# EAGLE design Čos - POC (EAGLE 9.4.0)
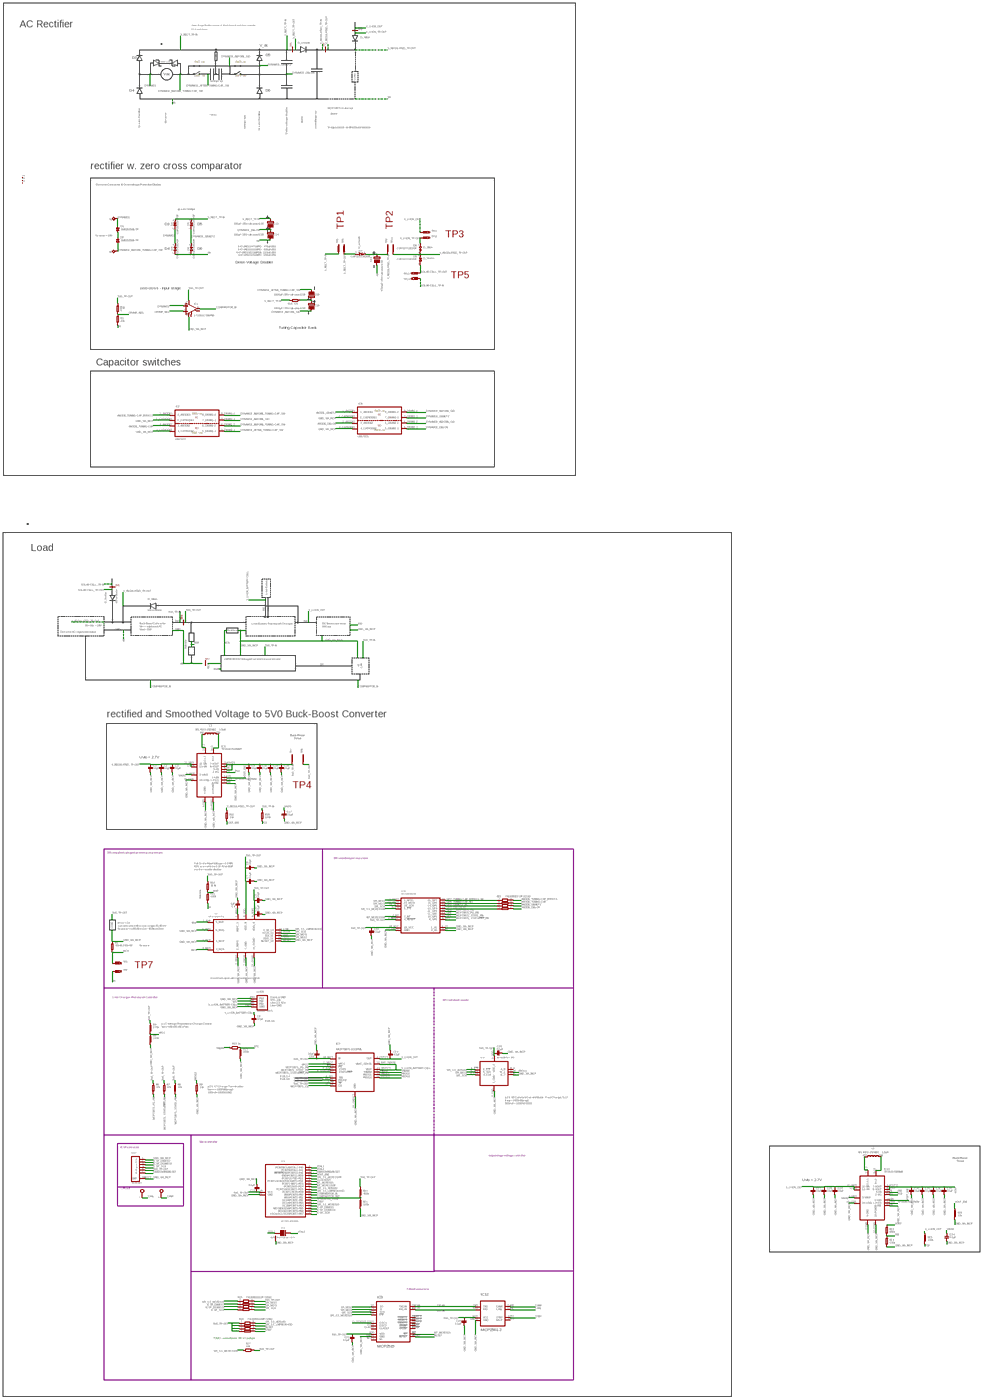
[diagram p0: schematic, sheet 1, overview]
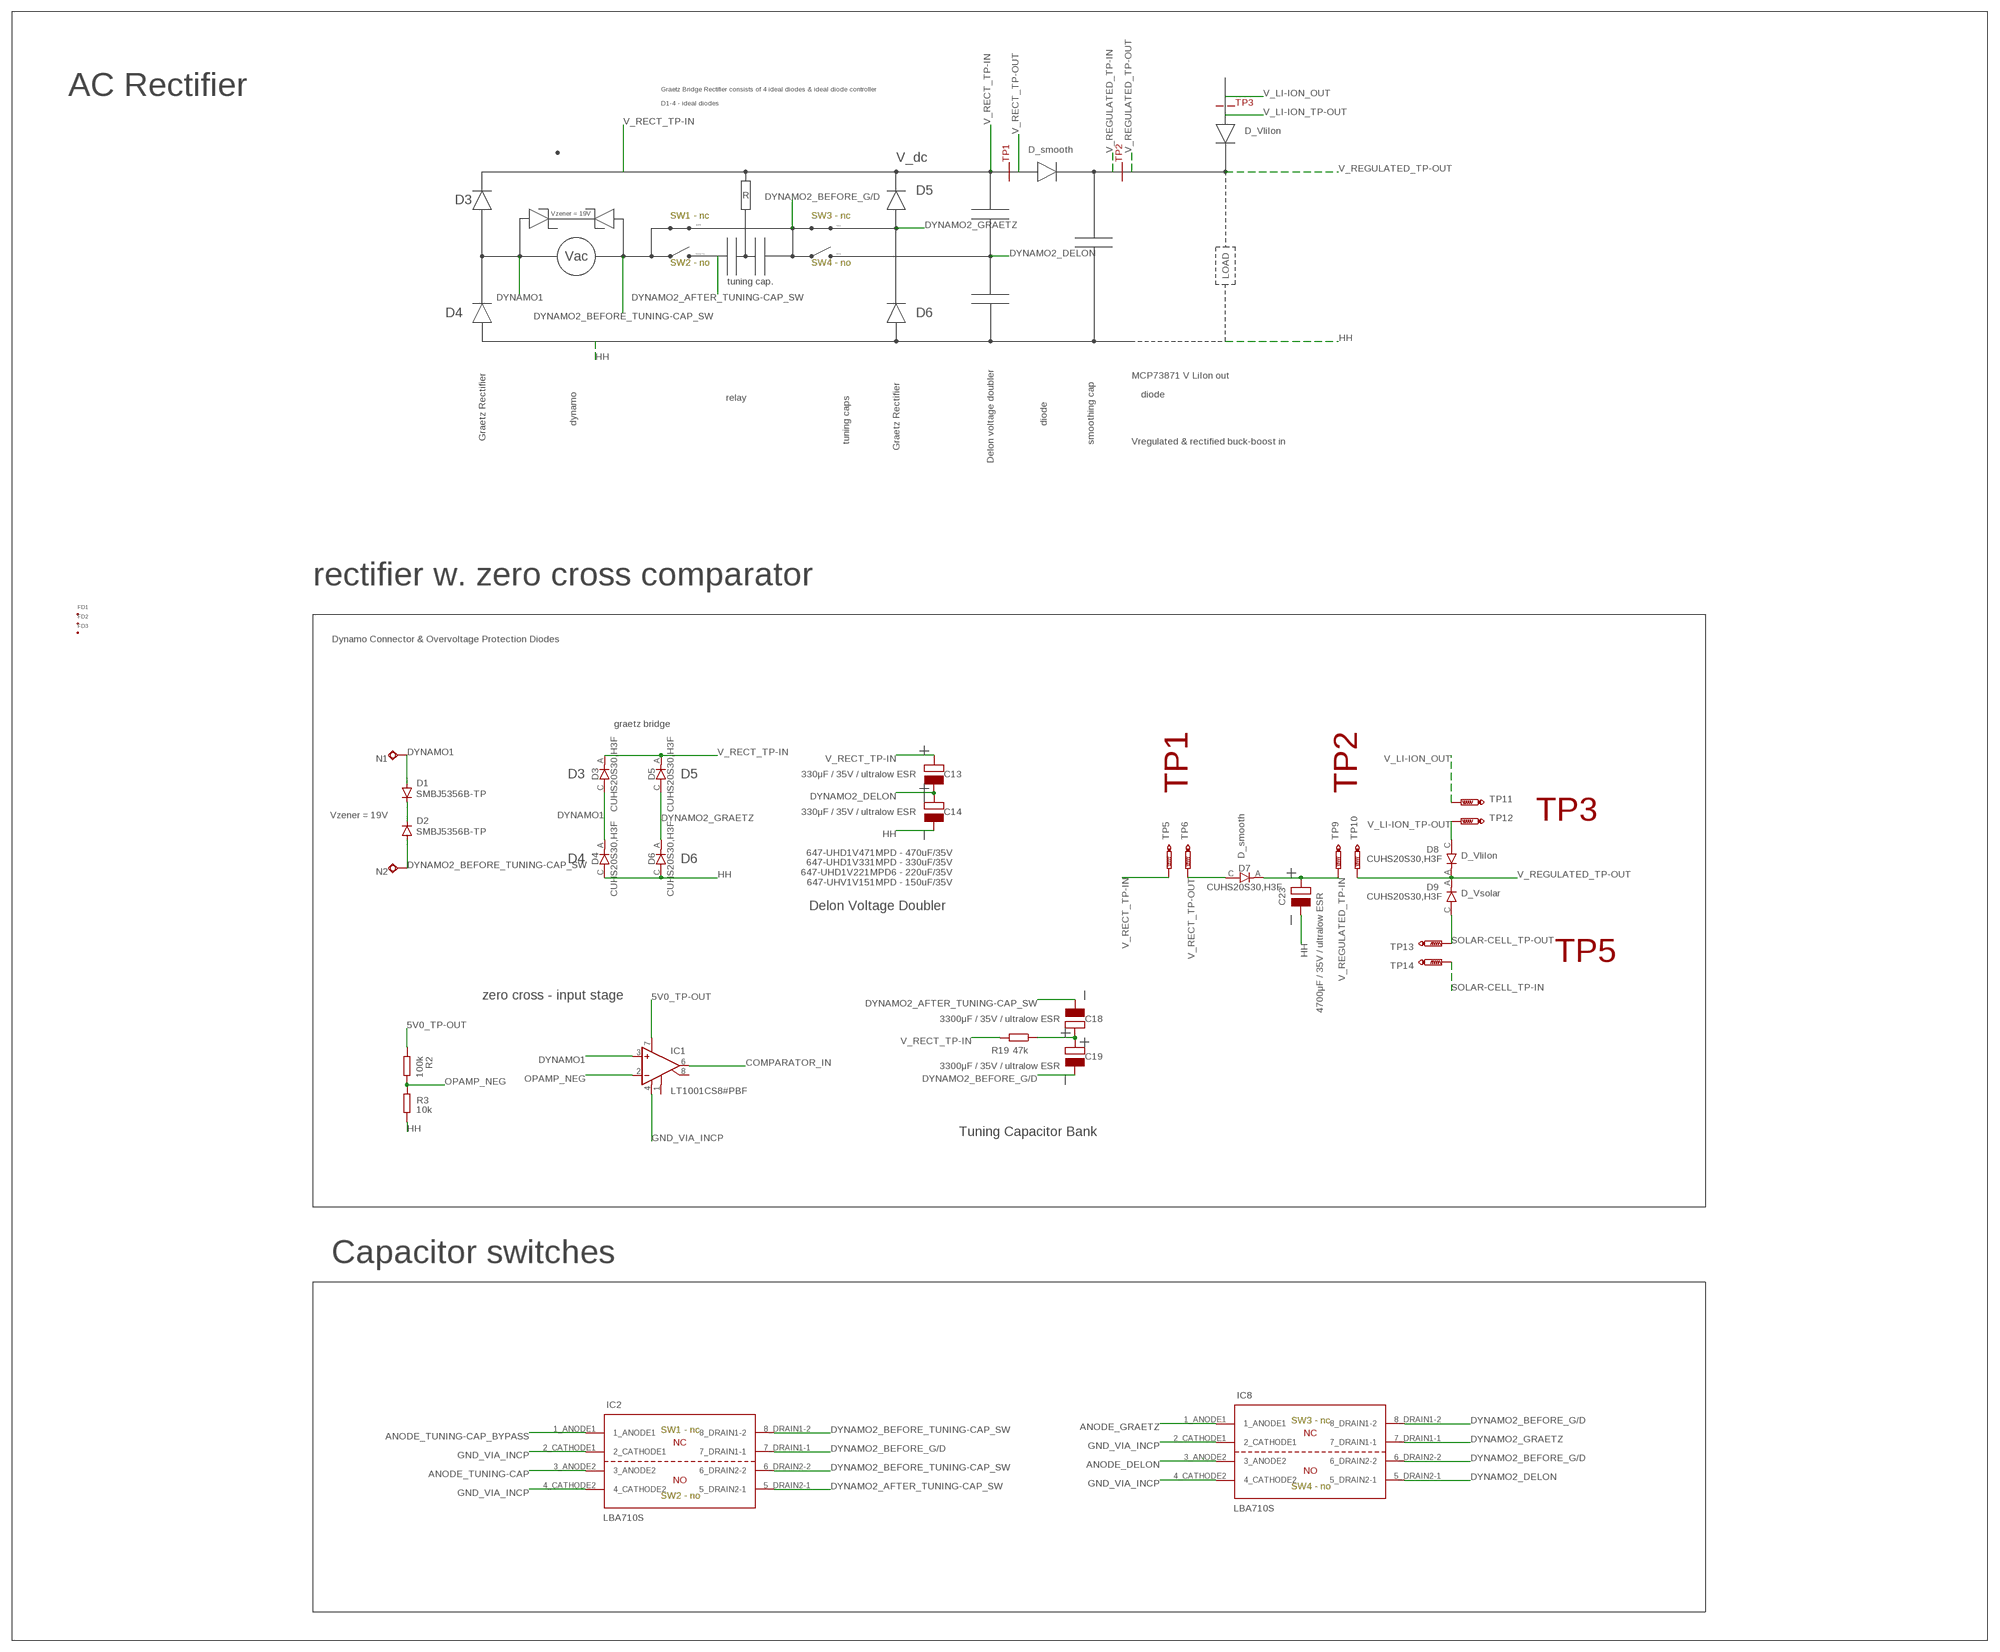
[diagram p1: schematic, sheet 1, part 1 of 5]
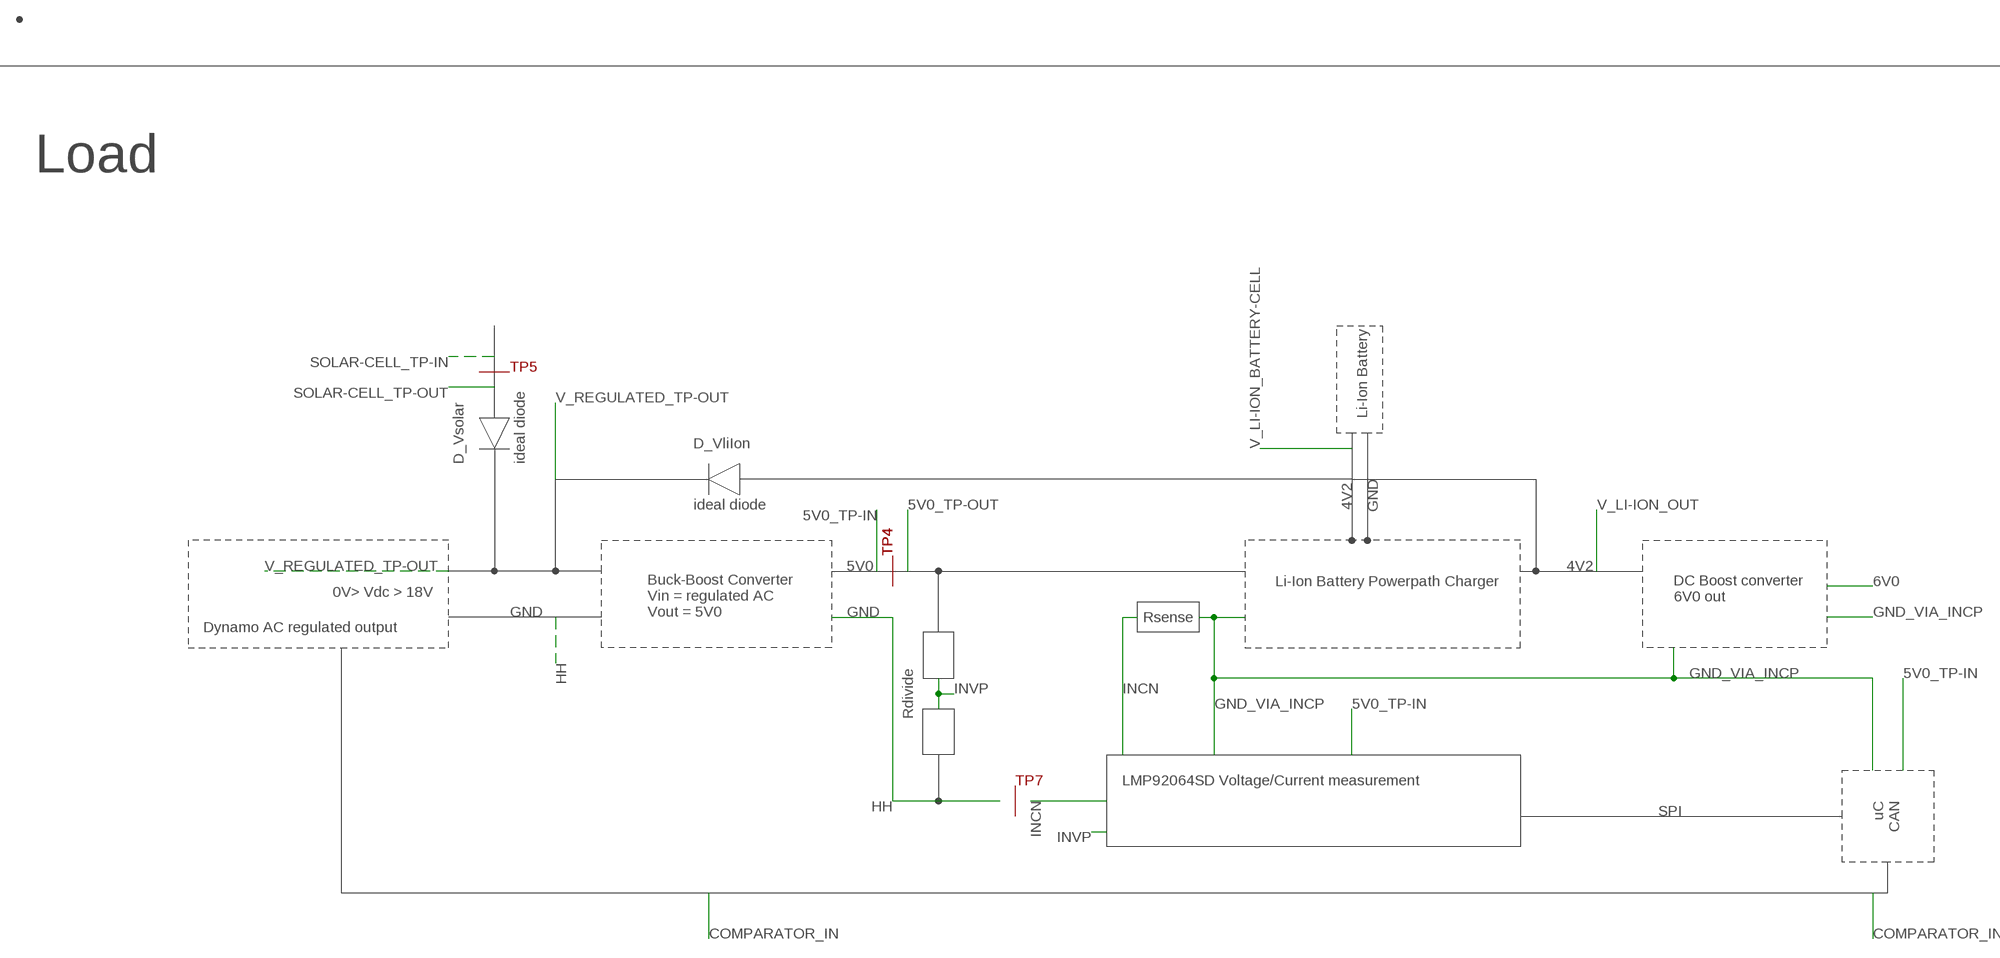
[diagram p2: schematic, sheet 1, part 2 of 5]
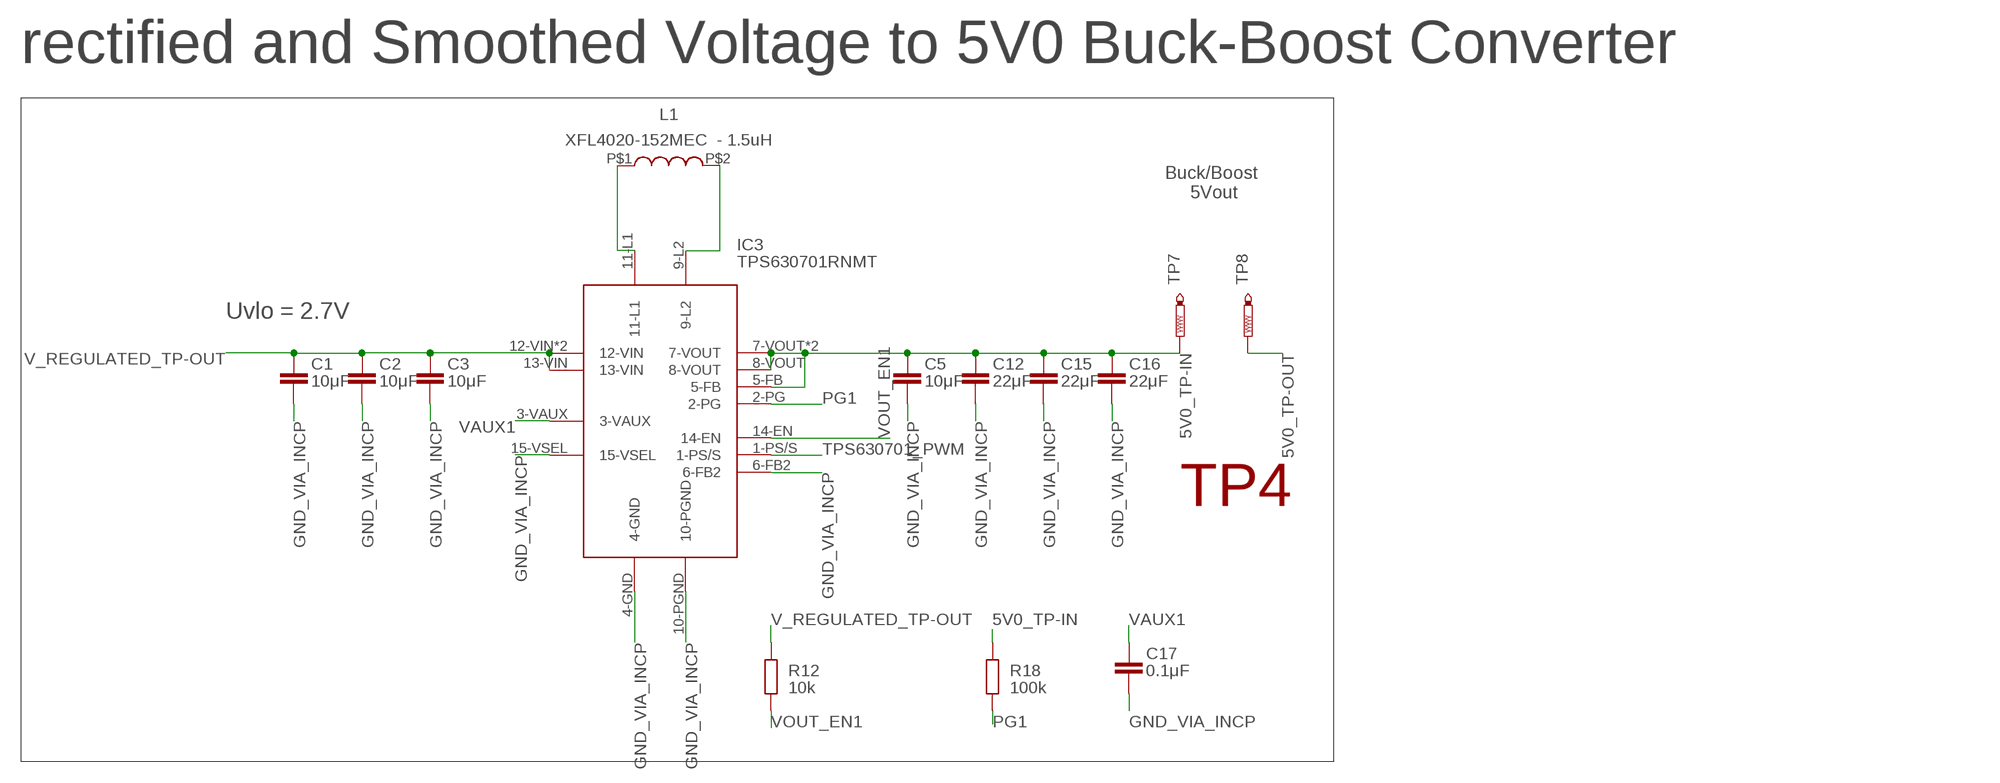
[diagram p3: schematic, sheet 1, part 3 of 5]
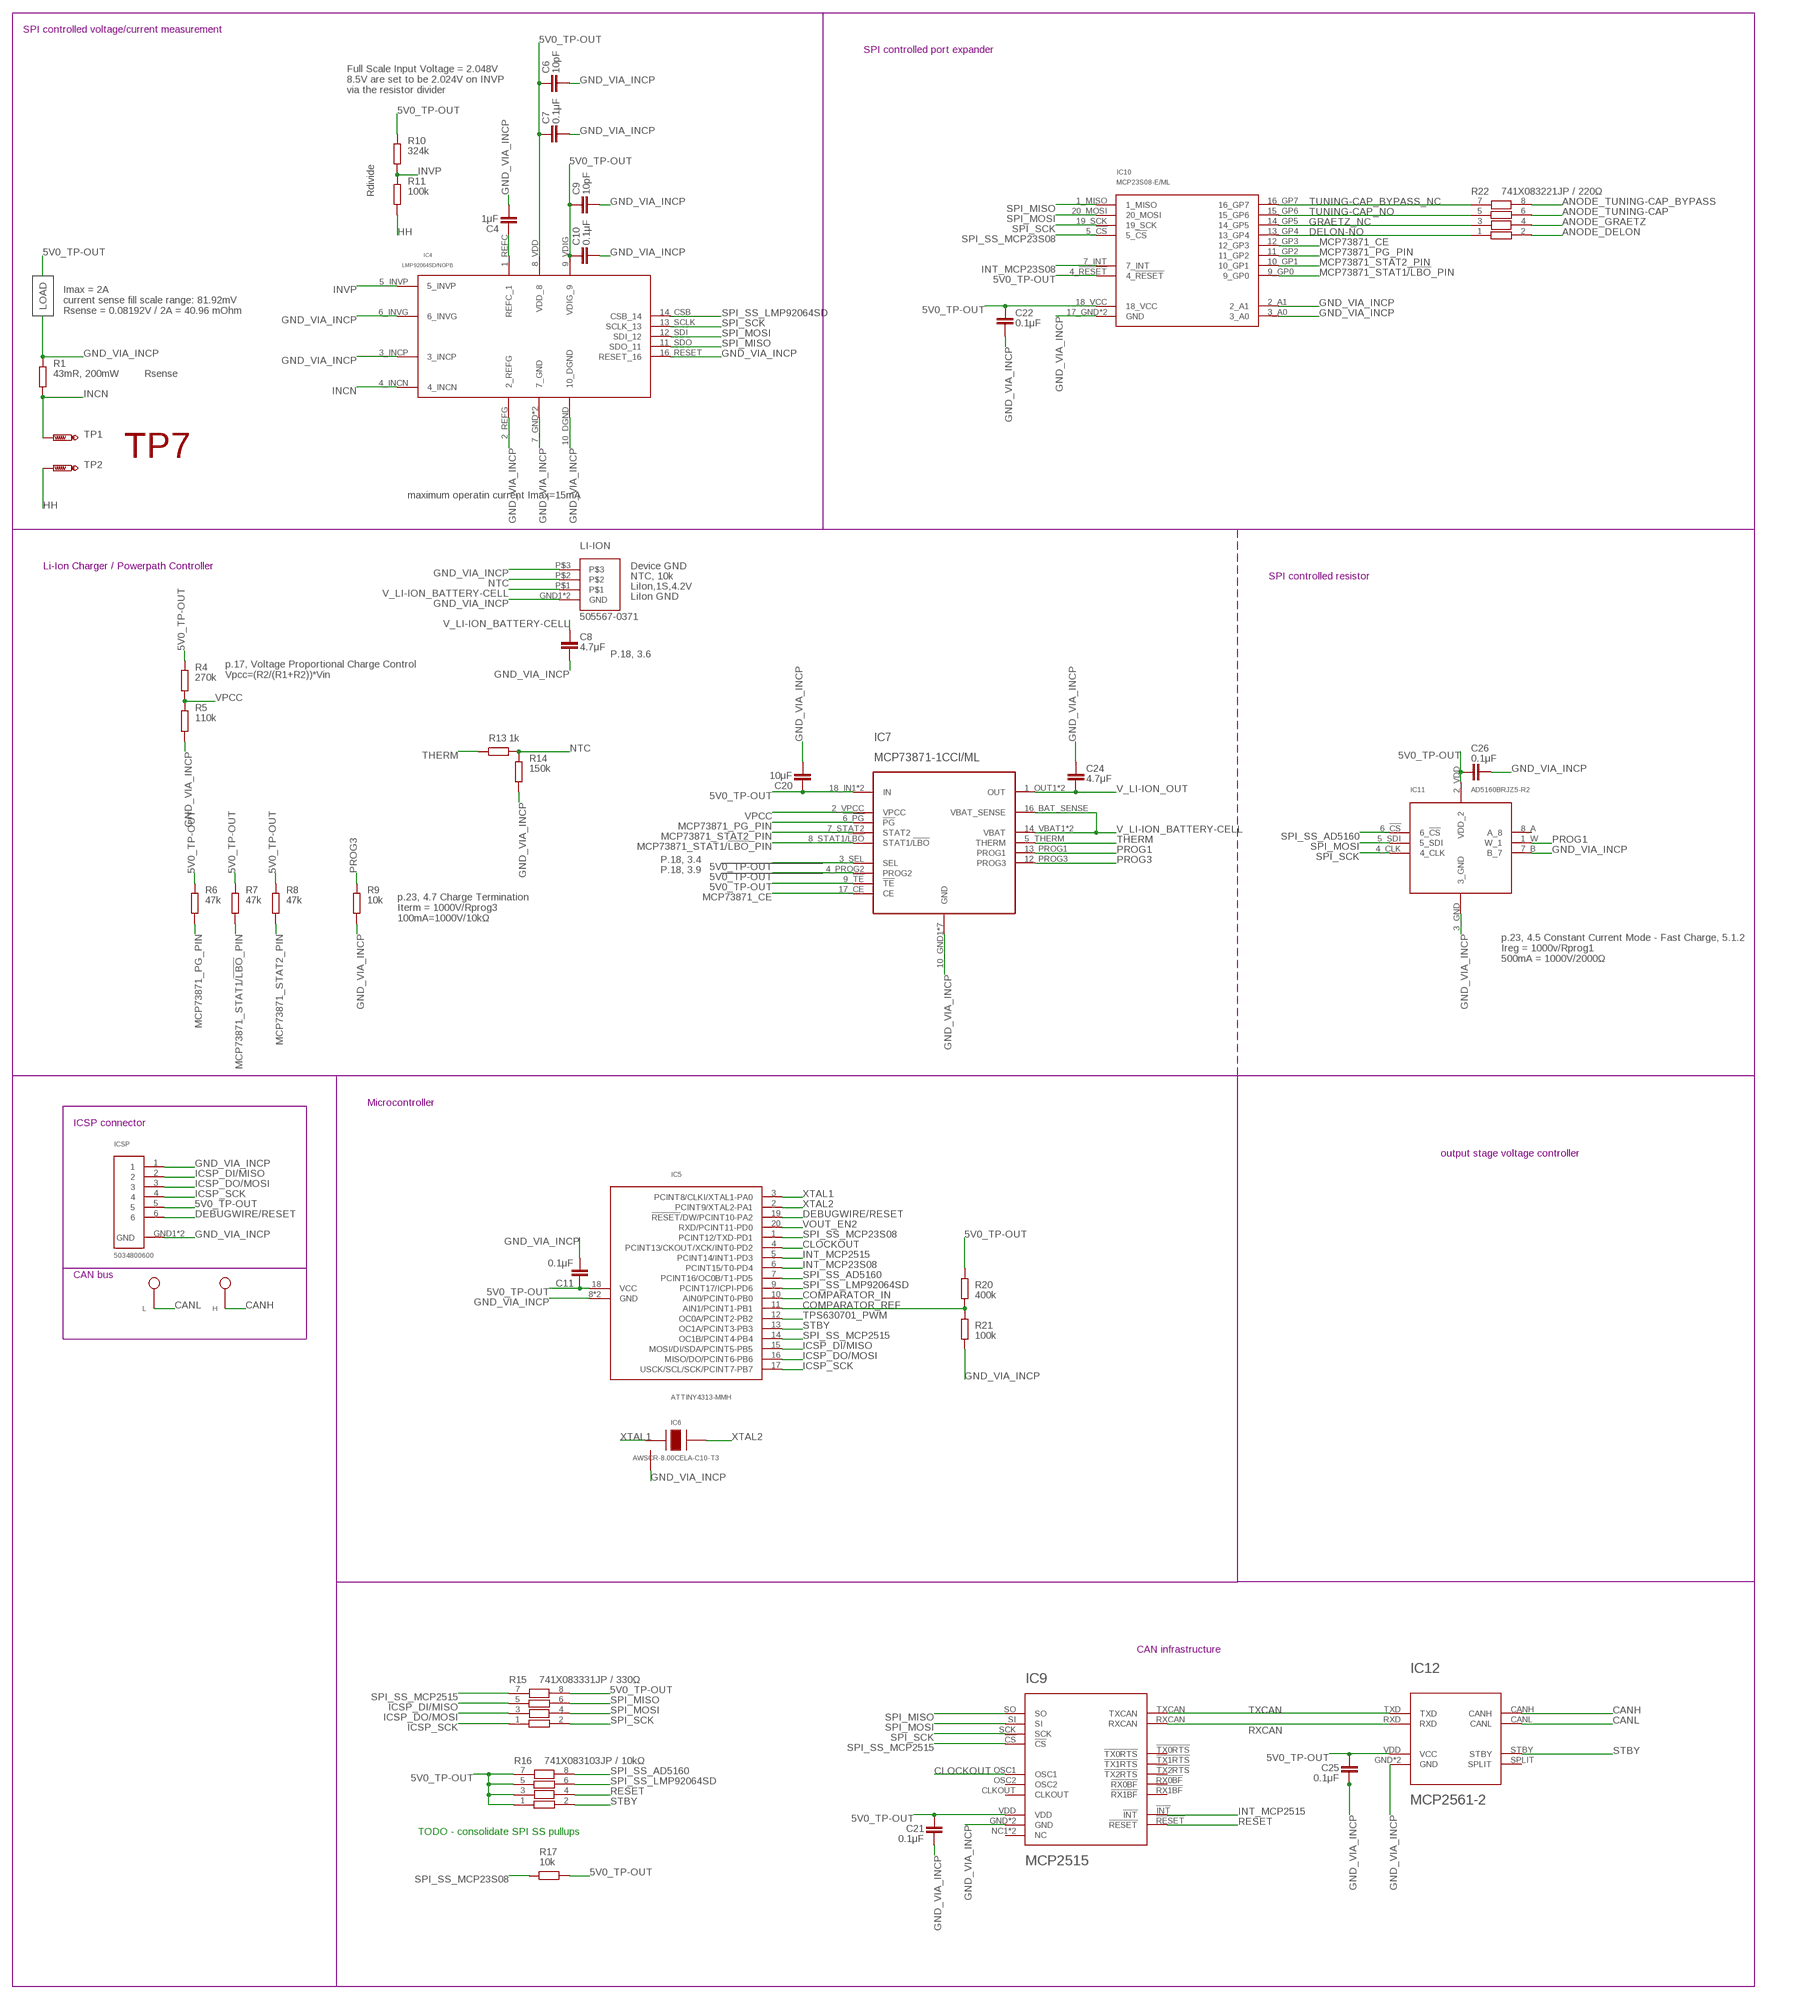
[diagram p4: schematic, sheet 1, part 4 of 5]
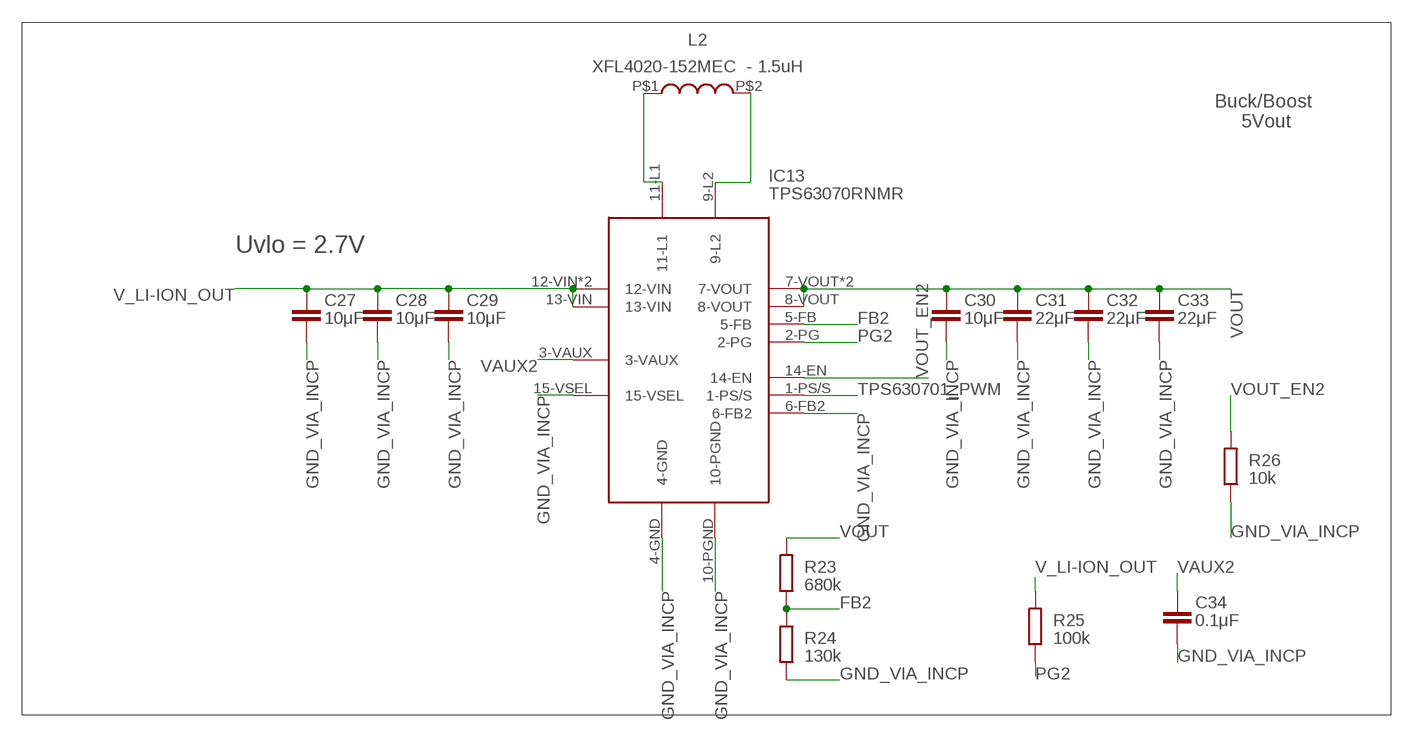
[diagram p5: schematic, sheet 1, part 5 of 5]

## Parts
C1  10μF  C-EUC0805  [C0805]
C2  10μF  C-EUC0805  [C0805]
C3  10μF  C-EUC0603  [C0603]
C4  1μF  C-EUC0402  [C0402]
C5  10μF  C-EUC0603  [C0603]
C6  10pF  C-EUC0402  [C0402]
C7  0.1μF  C-EUC0402  [C0402]
C8  4.7μF  C-EUC0402  [C0402]
C9  10pF  C-EUC0402  [C0402]
C10  0.1μF  C-EUC0402  [C0402]
C11  0.1μF  C-EUC0402  [C0402]
C12  22μF  C-EUC0805  [C0805]
C13  330μF / 35V / ultralow ESR  C-POL  [TH]
C14  330μF / 35V / ultralow ESR  C-POL  [TH]
C15  22μF  C-EUC0805  [C0805]
C16  22μF  C-EUC0805  [C0805]
C17  0.1μF  C-EUC0402  [C0402]
C18  3300μF / 35V / ultralow ESR  C-POL  [TH]
C19  3300μF / 35V / ultralow ESR  C-POL  [TH]
C20  10μF  C-EUC0402  [C0402]
C21  0.1μF  C-EUC0402  [C0402]
C22  0.1μF  C-EUC0402  [C0402]
C23  4700μF / 35V / ultralow ESR  C-POL  [TH]
C24  4.7μF  C-EUC0402  [C0402]
C25  0.1μF  C-EUC0402  [C0402]
C26  0.1μF  C-EUC0402  [C0402]
C27  10μF  C-EUC0805  [C0805]
C28  10μF  C-EUC0805  [C0805]
C29  10μF  C-EUC0603  [C0603]
C30  10μF  C-EUC0603  [C0603]
C31  22μF  C-EUC0805  [C0805]
C32  22μF  C-EUC0805  [C0805]
C33  22μF  C-EUC0805  [C0805]
C34  0.1μF  C-EUC0402  [C0402]
D1  SMBJ5356B-TP  DIODE-DO214AA  [DO214AA]
D2  SMBJ5356B-TP  DIODE-DO214AA  [DO214AA]
D3  CUHS20S30,H3F  CUHS20S30  [US2H]
D4  CUHS20S30,H3F  CUHS20S30  [US2H]
D5  CUHS20S30,H3F  CUHS20S30  [US2H]
D6  CUHS20S30,H3F  CUHS20S30  [US2H]
D7  CUHS20S30,H3F  CUHS20S30  [US2H]
D8  CUHS20S30,H3F  CUHS20S30  [US2H]
D9  CUHS20S30,H3F  CUHS20S30  [US2H]
FD1  FID_40MIL  [FID_040]
FD2  FID_40MIL  [FID_040]
FD3  FID_40MIL  [FID_040]
H  CAN High  TPSMT-1.2MM  [SMT-1.2MM]
IC1  LT1001CS8#PBF  LT1007CS8  [SO08]
IC2  LBA710S  LBA710  [SMD_DIP6]
IC3  TPS630701RNMT  TPS630701  [VQFN]
IC4  LMP92064SD/NOPB  LMP92064SD  [WSON-16]
IC5  ATTINY4313-MMH  ATTINY4313VQFN-20  [VQFN-20]
IC6  AWSCR-8.00CELA-C10-T3  PRQV  [SMT]
IC7  MCP73871-1CCI/ML  MCP73871-2AAI/ML  [QFN50P400X400X100-21N]
IC8  LBA710S  LBA710  [SMD_DIP6]
IC9  MCP2515  MCP2515-I-ML  [QFN20]
IC10  MCP23S08-E/ML  MCP23S08  [QFN20]
IC11  AD5160BRJZ5-R2  AD5160  [SOT-23-8]
IC12  MCP2561-2  [DFN10]
IC13  TPS63070RNMR  TPS630701  [VQFN]
ICSP  5034800600  [SMT]
L  CAN Low  TPSMT-1.2MM  [SMT-1.2MM]
L1  XFL4020-152MEC - 1.5uH  XFL4020-152MEC  [SMD]
L2  XFL4020-152MEC - 1.5uH  XFL4020-152MEC  [SMD]
LI-ION  505567-0371  505567  [SMT]
N1  Li-Ion Cell +  TPSQPAD1-13  [P1-13]
N2  Li-Ion Cell +  TPSQPAD1-13  [P1-13]
R1  43mR, 200mW  R-EU_R2512  [R2512]
R2  100k  R-EU_R0402  [R0402]
R3  10k  R-EU_R0402  [R0402]
R4  270k  R-EU_R0402  [R0402]
R5  110k  R-EU_R0402  [R0402]
R6  47k  R-EU_R0402  [R0402]
R7  47k  R-EU_R0402  [R0402]
R8  47k  R-EU_R0402  [R0402]
R9  10k  R-EU_R0402  [R0402]
R10  324k  R-EU_R0402  [R0402]
R11  100k  R-EU_R0402  [R0402]
R12  10k  R-EU_R0402  [R0402]
R13  1k  R-EU_R0402  [R0402]
R14  150k  R-EU_R0402  [R0402]
R15  741X083331JP / 330Ω  741X083331JP  [0402-4R]
R16  741X083103JP / 10kΩ  741X083331JP  [0402-4R]
R17  10k  R-EU_R0402  [R0402]
R18  100k  R-EU_R0402  [R0402]
R19  47k  R-EU_R0402  [R0402]
R20  400k  R-EU_R0402  [R0402]
R21  100k  R-EU_R0402  [R0402]
R22  741X083221JP / 220Ω  741X083331JP  [0402-4R]
R23  680k  R-EU_R0402  [R0402]
R24  130k  R-EU_R0402  [R0402]
R25  100k  R-EU_R0402  [R0402]
R26  10k  R-EU_R0402  [R0402]
TP1  PTR1TP10SQ  [TP10SQ]
TP2  PTR1TP10SQ  [TP10SQ]
TP5  PTR1TP10SQ  [TP10SQ]
TP6  PTR1TP10SQ  [TP10SQ]
TP7  PTR1TP10SQ  [TP10SQ]
TP8  PTR1TP10SQ  [TP10SQ]
TP9  PTR1TP10SQ  [TP10SQ]
TP10  PTR1TP10SQ  [TP10SQ]
TP11  PTR1TP10SQ  [TP10SQ]
TP12  PTR1TP10SQ  [TP10SQ]
TP13  PTR1TP10SQ  [TP10SQ]
TP14  PTR1TP10SQ  [TP10SQ]

## Nets
5V0_TP-IN [5V0]: C5.1 C12.1 C15.1 C16.1 IC3.5-FB IC3.7-VOUT IC3.8-VOUT IC3.VOUT(7-VOUT) R18.2 TP7.TP
5V0_TP-OUT [5V0]: C6.1 C7.1 C9.1 C10.1 C11.1 C20.1 C21.1 C22.1 C25.1 C26.1 IC1.7(V+) IC4.8_VDD(VDD_8) IC4.9_VDIG(VDIG_9) IC5.18(VCC) IC7.3_SEL(SEL) IC7.4_PROG2(PROG2) IC7.9_!TE!(!TE!) IC7.18_IN1(IN) IC7.19_IN2(IN) IC9.VDD IC10.4_!RESET! IC10.18_VCC IC11.2_VDD(VDD_2) IC12.VDD(VCC) ICSP.5 R2.1 R4.2 R6.2 R7.2 R8.2 R10.2 R15.8 R16.1 R16.3 R16.5 R16.7 R17.2 R20.1 TP8.TP
ANODE_DELON [signal]: IC8.3_ANODE2 R22.2
ANODE_GRAETZ [signal]: IC8.1_ANODE1 R22.4
ANODE_TUNING-CAP [signal]: IC2.3_ANODE2 R22.6
ANODE_TUNING-CAP_BYPASS [signal]: IC2.1_ANODE1 R22.8
CANH [signal]: H.P$1(TP$1) IC12.CANH
CANL [signal]: IC12.CANL L.P$1(TP$1)
CLOCKOUT [signal]: IC5.4(PCINT13/CKOUT/XCK/INT0-PD2) IC9.OSC1
COMPARATOR_IN [signal]: IC1.6(OUT) IC5.10(AIN0/PCINT0-PB0)
COMPARATOR_REF: IC5.11(AIN1/PCINT1-PB1) R20.2 R21.1
DEBUGWIRE/RESET [signal]: IC5.19(!RESET!/DW/PCINT10-PA2) ICSP.6
DELON-NO [signal]: IC10.13_GP4 R22.1
DYNAMO1 [DYNAMO_OUT]: D1.A D3.C D4.A IC1.3(+IN) N1.TP
DYNAMO2_AFTER_TUNING-CAP_SW [DYNAMO_OUT]: C18.NEG IC2.5_DRAIN2-1
DYNAMO2_BEFORE_G/D [DYNAMO_OUT]: C19.NEG IC2.7_DRAIN1-1 IC8.6_DRAIN2-2 IC8.8_DRAIN1-2
DYNAMO2_BEFORE_TUNING-CAP_SW [DYNAMO_OUT]: D2.A IC2.6_DRAIN2-2 IC2.8_DRAIN1-2 N2.TP
DYNAMO2_DELON [DYNAMO_OUT]: C13.NEG C14.POS IC8.5_DRAIN2-1
DYNAMO2_GRAETZ [DYNAMO_OUT]: D5.C D6.A IC8.7_DRAIN1-1
FB2: IC13.5-FB R23.1 R24.2
GND_VIA_INCP [GND_VIA_INCP]: C1.2 C2.2 C3.2 C4.2 C5.2 C6.2 C7.2 C8.2 C9.2 C10.2 C11.2 C12.2 C15.2 C16.2 C17.2 C20.2 C21.2 C22.2 C24.1 C25.2 C26.2 C27.2 C28.2 C29.2 C30.2 C31.2 C32.2 C33.2 C34.2 IC1.4(V-) IC2.2_CATHODE1 IC2.4_CATHODE2 IC3.4-GND IC3.6-FB2 IC3.10-PGND IC3.15-VSEL IC4.2_REFG IC4.3_INCP IC4.6_INVG IC4.7_GND IC4.10_DGND IC4.16_RESET(RESET_16) IC4.GND1(7_GND) IC5.8(GND) IC5.GND IC6.GND IC7.10_GND1(GND) IC7.11_GND2(GND) IC7.GND2(GND) IC7.GND3(GND) IC7.GND4(GND) IC7.GND5(GND) IC7.GND6(GND) IC8.2_CATHODE1 IC8.4_CATHODE2 IC9.GND IC9.GND6(GND) IC10.2_A1 IC10.3_A0 IC10.17_GND(GND) IC10.GND IC11.3_GND IC11.7_B(B_7) IC12.GND IC12.VSS(GND) IC13.4-GND IC13.6-FB2 IC13.10-PGND IC13.15-VSEL ICSP.1 ICSP.GND1(GND) ICSP.GND2(GND) LI-ION.GND1(GND) LI-ION.GND2(GND) LI-ION.P$3 R1.2 R5.1 R9.1 R14.1 R21.2 R24.1 R26.1
GRAETZ_NC [signal]: IC10.14_GP5 R22.3
HH: C14.NEG C23.NEG D4.C D6.C R3.1 R11.1 TP2.TP
ICSP_DI/MISO [signal]: IC5.15(MOSI/DI/SDA/PCINT5-PB5) ICSP.2 R15.5
ICSP_DO/MOSI [signal]: IC5.16(MISO/DO/PCINT6-PB6) ICSP.3 R15.3
ICSP_SCK [signal]: IC5.17(USCK/SCL/SCK/PCINT7-PB7) ICSP.4 R15.1
INCN [GND_VIA_INCP]: IC4.4_INCN R1.1 TP1.TP
INT_MCP23S08 [signal]: IC5.6(PCINT15/T0-PD4) IC10.7_INT
INT_MCP2515 [signal]: IC5.5(PCINT14/INT1-PD3) IC9.!INT!
INVP [signal]: IC4.5_INVP R10.1 R11.2
MCP73871_CE [signal]: IC7.17_CE(CE) IC10.12_GP3
MCP73871_PG_PIN [signal]: IC7.!6_PG!(!PG!) IC10.11_GP2 R6.1
MCP73871_STAT1/!LBO!_PIN [signal]: IC7.8_STAT1/!LBO!(STAT1/!LBO!) IC10.9_GP0 R7.1
MCP73871_STAT2_PIN [signal]: IC7.7_STAT2(STAT2) IC10.10_GP1 R8.1
N$1 [5V0]: IC3.11-L1 L1.P$1
N$5 [5V0]: IC3.9-L2 L1.P$2
N$9 [5V0]: IC13.11-L1 L2.P$1
N$10 [5V0]: IC13.9-L2 L2.P$2
N$17 [signal]: C4.1 IC4.1_REFC(REFC_1)
NTC [signal]: LI-ION.P$2 R13.2 R14.2
OPAMP_NEG: IC1.2(-IN) R2.2 R3.2
PG1 [signal]: IC3.2-PG R18.1
PG2 [signal]: IC13.2-PG R25.1
PROG1 [signal]: IC7.13_PROG1(PROG1) IC11.1_W(W_1)
PROG3 [signal]: IC7.12_PROG3(PROG3) R9.2
RESET [signal]: IC9.!RESET! R16.4
RXCAN [signal]: IC9.RXCAN IC12.RXD
SOLAR-CELL_TP-IN [SOLAR-CELL]: TP14.TP
SOLAR-CELL_TP-OUT [SOLAR-CELL]: D9.C TP13.TP
SPI_MISO [signal]: IC4.11_SDO(SDO_11) IC9.SO IC10.1_MISO R15.6
SPI_MOSI [signal]: IC4.12_SDI(SDI_12) IC9.SI IC10.20_MOSI IC11.5_SDI R15.4
SPI_SCK [signal]: IC4.13_SCLK(SCLK_13) IC9.SCK IC10.19_SCK IC11.4_CLK R15.2
SPI_SS_AD5160 [signal]: IC5.7(PCINT16/OC0B/T1-PD5) IC11.6_!CS! R16.8
SPI_SS_LMP92064SD [signal]: IC4.14_CSB(CSB_14) IC5.9(PCINT17/ICPI-PD6) R16.6
SPI_SS_MCP23S08 [signal]: IC5.1(PCINT12/TXD-PD1) IC10.5_!CS! R17.1
SPI_SS_MCP2515 [signal]: IC5.14(OC1B/PCINT4-PB4) IC9.!CS! R15.7
STBY [signal]: IC5.13(OC1A/PCINT3-PB3) IC12.STBY R16.2
THERM [signal]: IC7.5_THERM(THERM) R13.1
TPS630701_PWM [signal]: IC3.1-PS/S IC5.12(OC0A/PCINT2-PB2) IC13.1-PS/S
TUNIN_CAP_BIAS [signal]: C18.POS C19.POS R19.1
TUNING-CAP_BYPASS_NC [signal]: IC10.16_GP7 R22.7
TUNING-CAP_NO [signal]: IC10.15_GP6 R22.5
TXCAN [signal]: IC9.TXCAN IC12.TXD
V_LI-ION_BATTERY-CELL [LI_ION-CELL]: C8.1 IC7.14_VBAT1(VBAT) IC7.15_VBAT2(VBAT) IC7.16_BAT_SENSE(VBAT_SENSE) LI-ION.P$1
V_LI-ION_OUT [V_LI-ION]: C24.2 C27.1 C28.1 C29.1 IC7.1_OUT1(OUT) IC7.20_OUT2(OUT) IC13.12-VIN IC13.13-VIN IC13.VIN(12-VIN) R25.2 TP11.TP
V_LI-ION_TP-OUT [V_LI-ION]: D8.C TP12.TP
V_RECT_TP-IN [V_DC]: C13.POS D3.A D5.A R19.2 TP5.TP
V_RECT_TP-OUT [V_DC]: D7.C TP6.TP
V_REGULATED_TP-IN [V_REGULATED]: C23.POS D7.A TP9.TP
V_REGULATED_TP-OUT [V_REGULATED]: C1.1 C2.1 C3.1 D8.A D9.A IC3.12-VIN IC3.13-VIN IC3.VIN(12-VIN) R12.2 TP10.TP
VAUX1 [signal]: C17.1 IC3.3-VAUX
VAUX2 [signal]: C34.1 IC13.3-VAUX
VOUT [5V0]: C30.1 C31.1 C32.1 C33.1 IC13.7-VOUT IC13.8-VOUT IC13.VOUT(7-VOUT) R23.2
VOUT_EN1 [signal]: IC3.14-EN R12.1
VOUT_EN2 [signal]: IC5.20(RXD/PCINT11-PD0) IC13.14-EN R26.2
VPCC [signal]: IC7.2_VPCC(VPCC) R4.1 R5.2
XTAL1 [signal]: IC5.3(PCINT8/CLKI/XTAL1-PA0) IC6.XTAL1
XTAL2 [signal]: IC5.2(PCINT9/XTAL2-PA1) IC6.XTAL2
ZENER_COMMON [DYNAMO_OUT]: D1.C D2.C
Unconnected: IC1.1(CMP1) IC1.8(CMP2) IC9.!RX0BF! IC9.!RX1BF! IC9.!TX0RTS! IC9.!TX1RTS! IC9.!TX2RTS! IC9.CLKOUT IC9.NC1(NC) IC9.NC2(NC) IC9.OSC2 IC11.8_A(A_8) IC12.SPLIT

## Notes on the sheet
- Graetz Bridge Rectifier consists of 4 ideal diodes & ideal diode controller
  
  D1-4 - ideal diodes
- AC Rectifier
- TP3
- D_VliIon
- D_smooth
- V_dc | TP1 | TP2
- D5
- R
- D3
- Vzener = 19V
- SW1 - nc | SW3 - nc
- graetz
- delon
- tuning cap | delon
- Vac
- SW2 - no | SW4 - no | LOAD
- tuning cap.
- D4 | D6
- MCP73871 V LiIon out
- relay | diode
- Graetz Rectifier
- Graetz Rectifier | Delon voltage doubler
- dynamo | diode
- tuning caps | smoothing cap | Vregulated & rectified buck-boost in
- rectifier w. zero cross comparator
- Dynamo Connector & Overvoltage Protection Diodes
- graetz bridge
- D3 | D5
- TP1 | TP2
- Vzener = 19V
- TP3
- 647-UHD1V471MPD - 470uF/35V
  647-UHD1V331MPD - 330uF/35V
  647-UHD1V221MPD6 - 220uF/35V
  647-UHV1V151MPD - 150uF/35V
- D4 | D6 | D_smooth | D_VliIon
- D_Vsolar
- Delon Voltage Doubler
- TP5
- zero cross - input stage
- Tuning Capacitor Bank
- Capacitor switches
- SW3 - nc
- SW1 - nc
- SW4 - no
- SW2 - no
- Load
- TP5
- Li-Ion Battery
- D_VliIon
- D_Vsolar | ideal diode
- GND
- ideal diode | 4V2
- TP4 | TP4
- 5V0 | 4V2
- 0V> Vdc > 18V | Li-Ion Battery Powerpath Charger
- DC Boost converter
  6V0 out
- GND
- Buck-Boost Converter
  Vin = regulated AC
  Vout = 5V0
- GND | Rsense
- Dynamo AC regulated output
- Rdivide
- TP7 | LMP92064SD Voltage/Current measurement
- uC
  CAN
- SPI
- rectified and Smoothed Voltage to 5V0 Buck-Boost Converter
- Buck/Boost 
  5Vout
- Uvlo = 2.7V
- TP4
- SPI controlled voltage/current measurement
- SPI controlled port expander
- Full Scale Input Voltage = 2.048V
  8.5V are set to be 2.024V on INVP
  via the resistor divider
- Rdivide
- Imax = 2A
  current sense fill scale range: 81.92mV
  Rsense = 0.08192V / 2A = 40.96 mOhm
- LOAD
- Rsense
- TP7
- maximum operatin current Imax=15mA
- Li-Ion Charger / Powerpath Controller | Device GND
- NTC, 10k | SPI controlled resistor
- LiIon,1S,4.2V
- LiIon GND
- P.18, 3.6
- p.17, Voltage Proportional Charge Control
  Vpcc=(R2/(R1+R2))*Vin
- P.18, 3.4
- P.18, 3.9
- p.23, 4.7 Charge Termination
  Iterm = 1000V/Rprog3
  100mA=1000V/10kΩ
- p.23, 4.5 Constant Current Mode - Fast Charge, 5.1.2
  Ireg = 1000v/Rprog1
  500mA = 1000V/2000Ω
- Microcontroller
- ICSP connector
- output stage voltage controller
- Buck/Boost 
  5Vout
- Uvlo = 2.7V
- CAN bus
- CAN infrastructure
- TODO - consolidate SPI SS pullups

## Library data of the parts
C1-C12 C15-C17 C20-C22 C24-C34 = rcl:C-EU: CAPACITOR, European symbol; SPICEPREFIX: C
C13 C14 C18 C19 C23 = C-Pol:C-POL
D1 D2 = diode:DIODE-: DIODE
D3-D9 = CUHS20S30 - Schottky Barrier Diode:CUHS20S30
FD1-FD3 = Fiducial:FID: Fiducial marks. Top and Bottom copper with stop mask
H L = signal testpoint:TP
IC1 = linear:LT10*: Low Noise, High Speed, Precision Operational Amplifiers Source: http://www.linear.com/pc/downloadDocument.do?navId=H0,C1,C1154,C1009,C1026,P1212,D2204
IC2 IC8 = LBA710 - Solid State Relay Form AB - NO&NC:LBA710
IC3 IC13 = TPS630701 - Buck Boost 5V regulator:TPS630701
IC4 = LMP92064SD - LMP92064 Precision Low-Side, 125-kSps Simultaneous Sampling Current Sensor and Voltage Monitor With SPI:LMP92064SD
IC5 = ATtiny4313 microcontroller:ATTINY4313; SPICEPREFIX: X
IC6 = PRQV8.00CR1510Y00L - 8MHz resonator:PRQV
IC7 = MCP73871 - Powerpath and Charge Controller:MCP73871-2AAI/ML: IC, BATTERY CHARGER, 1A; MPN: MCP73871-2AAI/ML; OC_FARNELL: 1642487; OC_NEWARK: 54M4955; PACKAGE: QFN-20; SUPPLIER: Microchip
IC9 = MCP2515-I-ML - Standalonce CAN Controller with SPI Interface:MCP2515-I-ML
IC10 = MCP23S08 - 8-Bit IO Expander with Serial Interface:MCP23S08
IC11 = ad5160 - 256-Position SPI-Compatible Digital Potentiometer:AD5160
IC12 = MCP2561-2 - High-Speed CAN Transceiver:MCP2561-2
ICSP = 5034800600 FPC Connector:5034800600
L1 L2 = XFL4020-152MEC Inductor 1.5uH:XFL4020-152MEC
LI-ION = 505567 - PCB Header:505567
N1 N2 = testpad:TPSQ: Test pad
R1-R14 R17-R21 R23-R26 = rcl:R-EU_: RESISTOR, European symbol; SPICEPREFIX: R
R15 R16 R22 = 74x-1133528 Resistor Array:741X083331JP
TP1 TP2 TP5-TP14 = testpad:PTR1: TEST PIN

## Net classes
0 GND: width 0.5 mm, drill 0.3 mm, clearance 0.2 mm
1 GND_VIA_INCP: width 0.5 mm, drill 0.3 mm, clearance 0.2 mm
2 DYNAMO_OUT: width 0.9 mm, drill 0.3 mm, clearance 0.5 mm
3 V_DC: width 0.3 mm, drill 0.3 mm, clearance 0.2 mm
4 V_REGULATED: width 0.3 mm, drill 0.3 mm, clearance 0.2 mm
5 V_LI-ION: width 0.3 mm, drill 0.3 mm, clearance 0.2 mm
6 5V0: width 0.3 mm, drill 0.3 mm, clearance 0.2 mm
7 6V0: width 0.3 mm, drill 0.3 mm, clearance 0.2 mm
8 SOLAR-CELL: width 0.3 mm, drill 0.3 mm, clearance 0.2 mm
9 signal: width 0.3 mm, drill 0.3 mm, clearance 0.2 mm

## Board
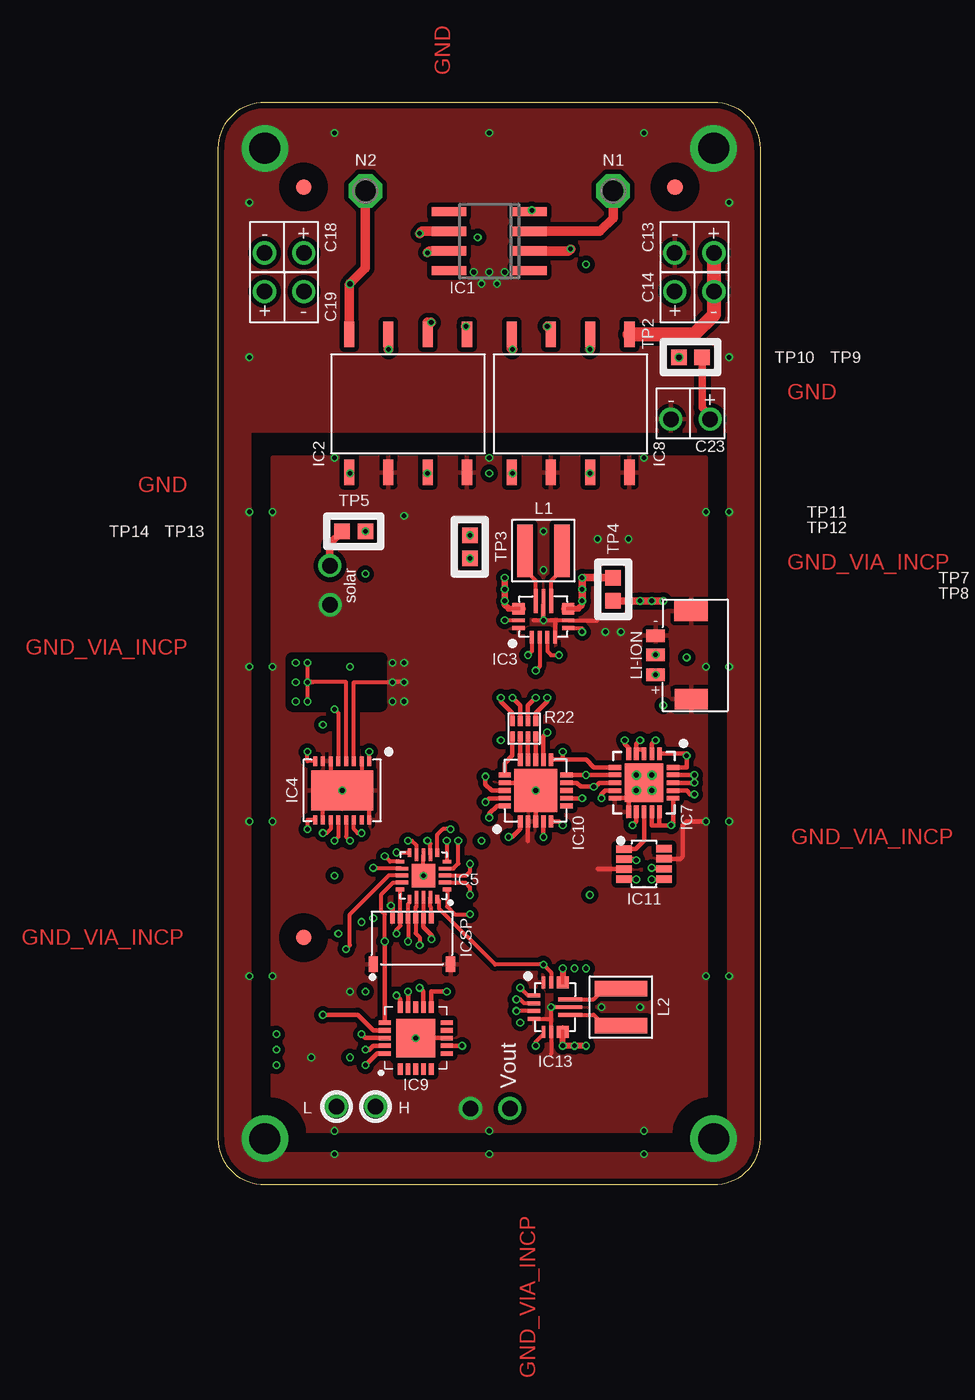
[diagram p6: board, top side]
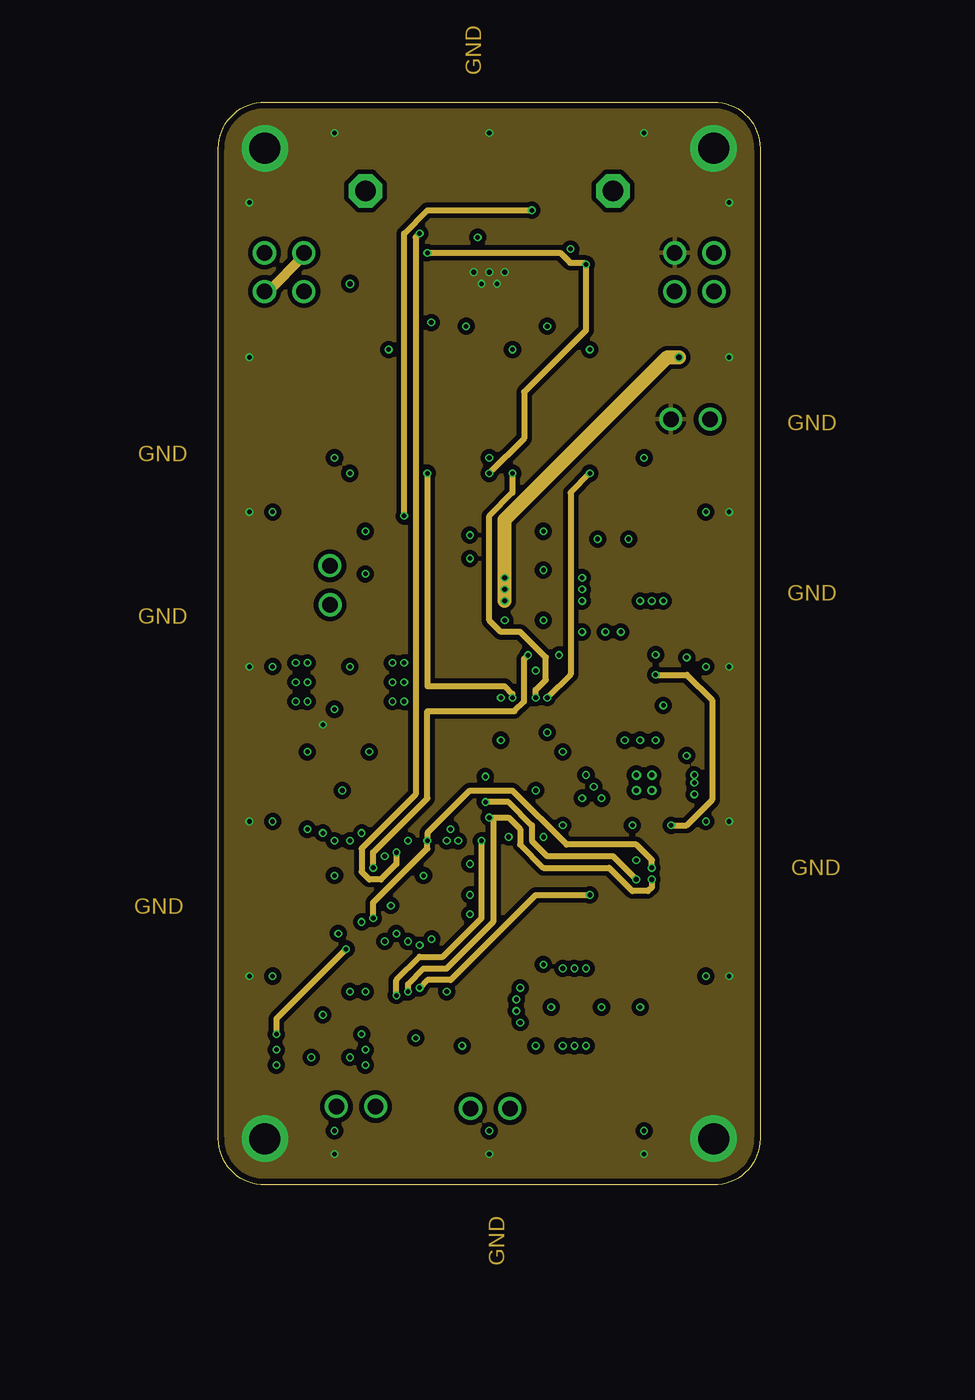
[diagram p7: board, inner layer Route2]
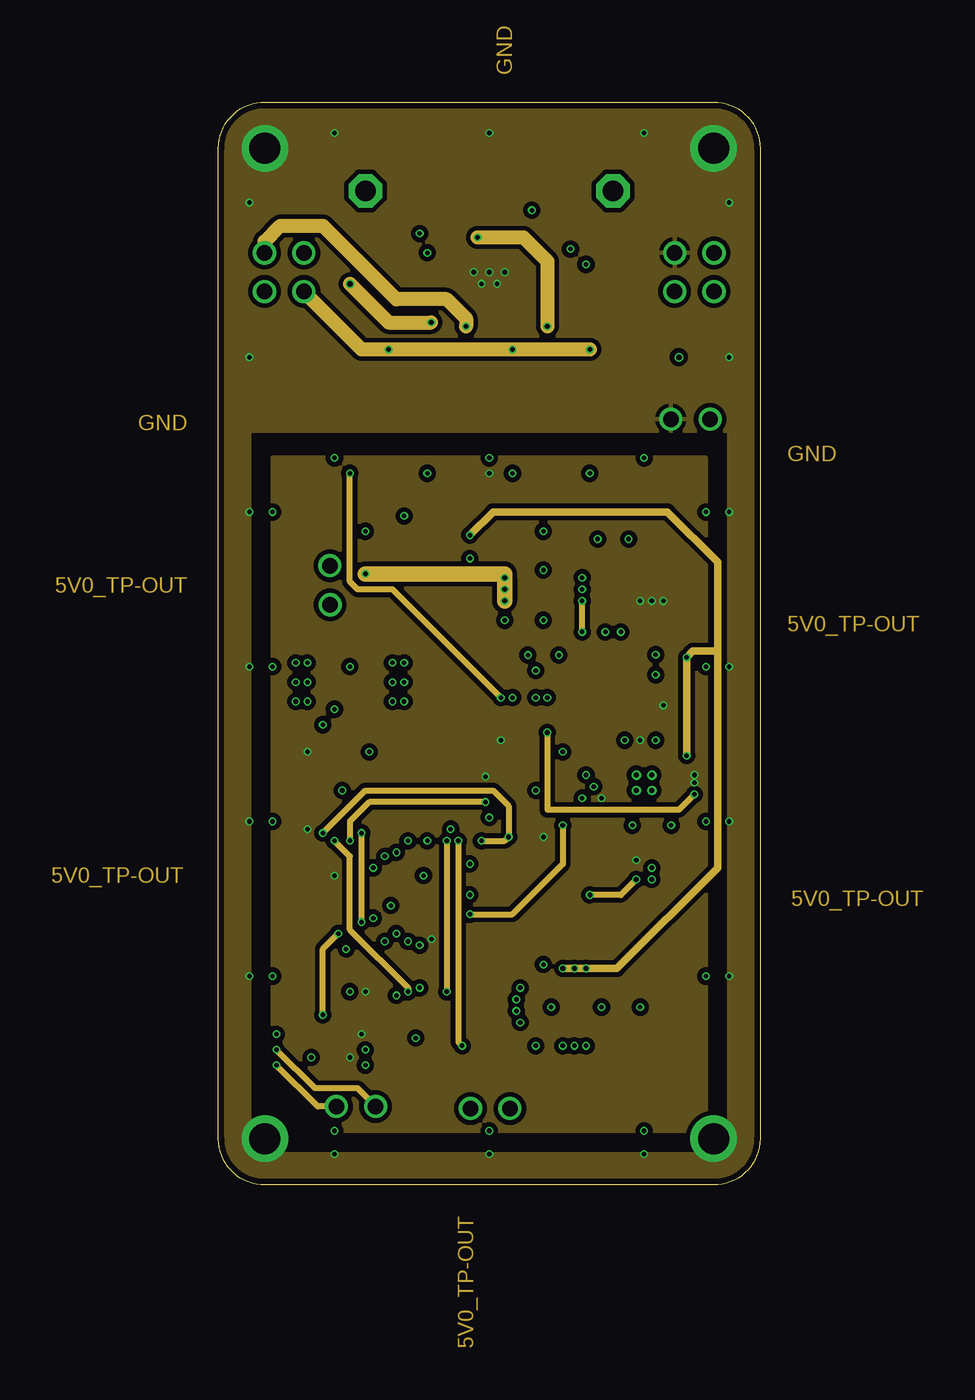
[diagram p8: board, inner layer Route15]
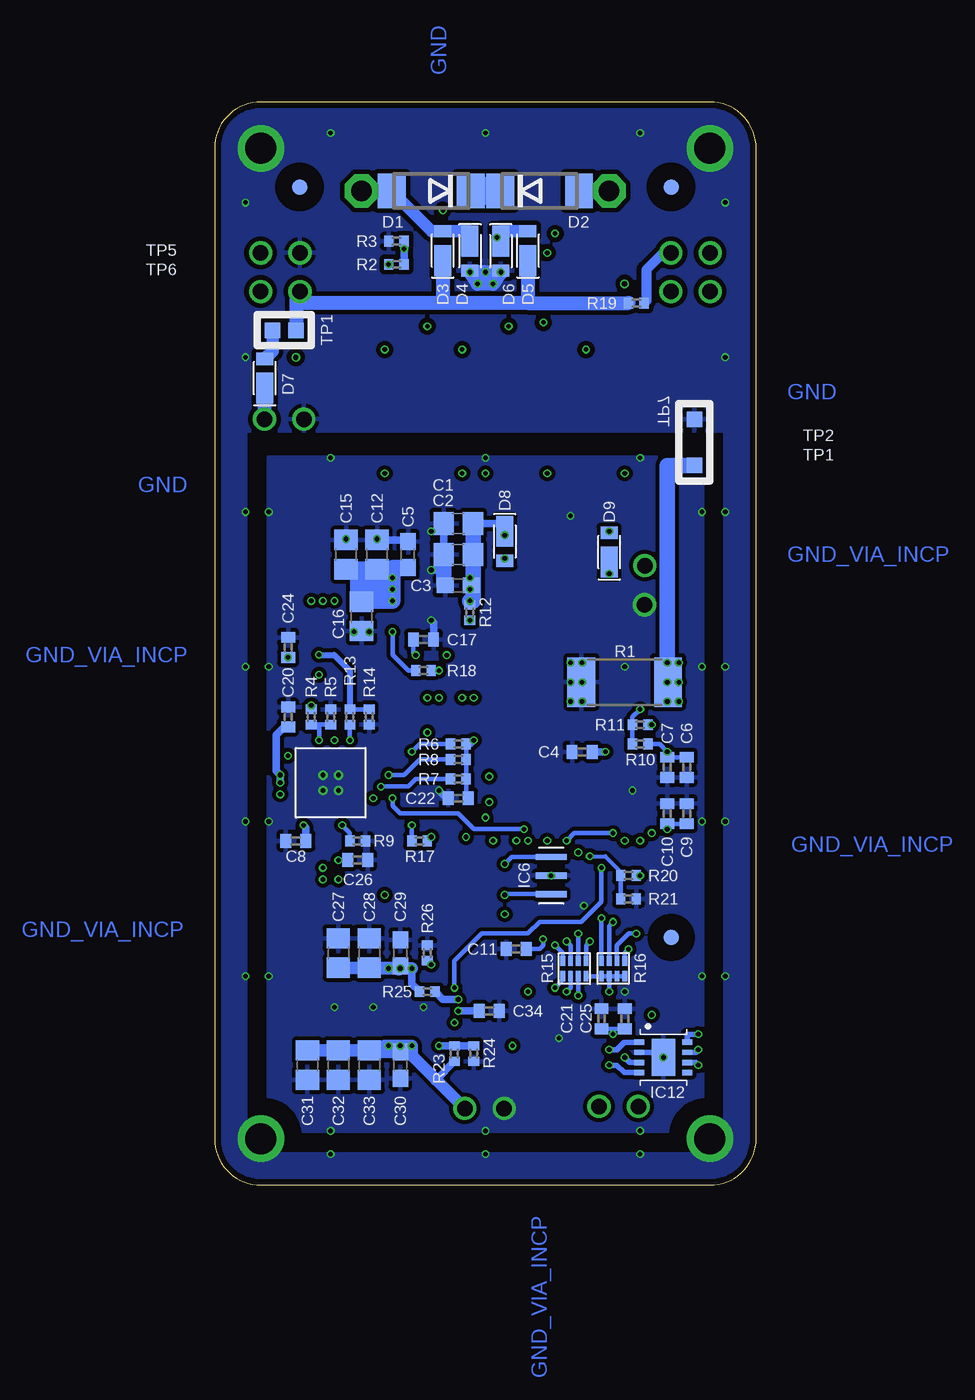
[diagram p9: board, bottom side, seen from below]

Size 35 x 70 mm. Coordinates in mm from the lower left corner, seen from the top.
Outline: 35,67 35,3 arc-90 32,0 3,0 arc-90 0,3 0,67 arc-90 3,70 32,70 arc-90 35,67
Copper layers (1*2*15*16): Top 0.035559375mm / dielectric 0.17018125mm / Route2 0.01778125mm / dielectric 47mil / Route15 0.01778125mm / dielectric 0.17018125mm / Bottom 0.035559375mm
Design rules "oshpark-4layer": minimum track width 5mil, minimum drill 10mil, track to track 5mil, track to pad 5mil, pad to pad 5mil, via to via 5mil, smd to smd 5mil, copper to edge 15mil, drill to drill 6mil, minimum pad ring 4mil, minimum via ring 4mil, stop-mask expansion 2.5mil, vias tented up to drill 0mil, thermal gap 10mil
tRestrict: area 4.8,27 to 10.5,34; 7 lines
bRestrict: 8 lines

### Footprints (pad centres in the part's own frame; a part is rotated, then mirrored left to right if it is on the bottom)
C0805 = smd 1.3 x 1.5: 1 -0.95,0; 2 0.95,0
C0603 = smd 1.1 x 1: 1 -0.85,0; 2 0.85,0
C0402 = smd 0.7 x 0.9: 1 -0.65,0; 2 0.65,0
TH = drill 1: NEG 1.27,0; POS -1.27,0
DO214AA = smd 1.8 x 2.2: A 2.55,0; C -2.55,0
US2H = smd 2 x 1.1: A -1,0 | smd 0.8 x 1.1: C 0.9,0
FID_040 = smd 1.016 x 1.016 bottom: FIDB 0,0 | smd 1.016 x 1.016: FIDT 0,0
SMT-1.2MM = smd 1.2 x 1.2: P$1 0,0
SO08 = smd 0.6 x 2.2: 1 -1.905,-2.6; 2 -0.635,-2.6; 3 0.635,-2.6; 4 1.905,-2.6; 5 1.905,2.6; 6 0.635,2.6; 7 -0.635,2.6; 8 -1.905,2.6
SMD_DIP6 = smd 0.65 x 1.65: 1_ANODE1 -3.81,-4.44; 2_CATHODE1 -1.27,-4.44; 3_ANODE2 1.27,-4.44; 4_CATHODE2 3.81,-4.44; 5_DRAIN2-1 3.81,4.48; 6_DRAIN2-2 1.27,4.48; 7_DRAIN1-1 -1.27,4.48; 8_DRAIN1-2 -3.81,4.48
VQFN = smd 0.8 x 0.25: 1-PS/S -1.35,0.75; 2-PG -1.35,0.25; 3-VAUX -1.35,-0.25; 4-GND -1.35,-0.75 | smd 0.25 x 0.8: 5-FB -0.75,-1.6; 6-FB2 -0.25,-1.6; 7-VOUT 0.25,-1.6; 8-VOUT 0.75,-1.6; 12-VIN 0.75,1.6; 13-VIN 0.25,1.6; 14-EN -0.25,1.6; 15-VSEL -0.75,1.6 | smd 1.55 x 0.25: 9-L2 0.99,-0.5; 11-L1 0.99,0.5 | smd 1.9 x 0.25: 10-PGND 0.815,0 | smd 0.6 x 0.25: VIN 0.5,1.325; VOUT 0.505,-1.325
WSON-16 = smd 0.25 x 0.6: 1_REFC -1.75,-1.9; 2_REFG -1.25,-1.9; 3_INCP -0.75,-1.9; 4_INCN -0.25,-1.9; 5_INVP 0.25,-1.9; 6_INVG 0.75,-1.9; 7_GND 1.25,-1.9; 8_VDD 1.75,-1.9; 9_VDIG 1.75,1.9; 10_DGND 1.25,1.9; 11_SDO 0.75,1.9; 12_SDI 0.25,1.9; 13_SCLK -0.25,1.9; 14_CSB -0.75,1.9; 15_RESERVED -1.25,1.9; 16_RESET -1.75,1.9 | smd 4 x 2.6: GND1 0,0
VQFN-20 = smd 0.55 x 0.25: 1 -1.52,0.9; 5 -1.52,-0.9; 11 1.52,-0.9; 15 1.52,0.9 | smd 0.8 x 0.25: 2 -1.4,0.45; 3 -1.4,0; 4 -1.4,-0.45; 12 1.4,-0.45; 13 1.4,0; 14 1.4,0.45 | smd 0.25 x 0.55: 6 -0.9,-1.48; 10 0.9,-1.48; 16 0.9,1.52; 20 -0.9,1.52 | smd 0.25 x 0.8: 7 -0.45,-1.35; 8 0,-1.35; 9 0.45,-1.35; 17 0.45,1.4; 18 0,1.4; 19 -0.45,1.4 | smd 1.5 x 1.5: GND 0,0
SMT = smd 0.4 x 2: GND 0,0; XTAL1 -1.2,0; XTAL2 1.2,0
QFN50P400X400X100-21N = smd 0.8 x 0.3: 1_OUT1 -1.88,0.991; 2_VPCC -1.88,0.508; 3_SEL -1.88,0; 4_PROG2 -1.88,-0.508; 5_THERM -1.88,-0.991; 11_GND2 1.88,-0.991; 12_PROG3 1.88,-0.508; 13_PROG1 1.88,0; 14_VBAT1 1.88,0.508; 15_VBAT2 1.88,0.991 | smd 0.3 x 0.8: 7_STAT2 -0.508,-1.88; 8_STAT1/!LBO! 0,-1.88; 9_!TE! 0.508,-1.88; 10_GND1 0.991,-1.88; 16_BAT_SENSE 0.991,1.88; 17_CE 0.508,1.88; 18_IN1 0,1.88; 19_IN2 -0.508,1.88; 20_OUT2 -0.991,1.88; !6_PG! -0.991,-1.88 | smd 2.5 x 2.5: GND2 0,0 | drill 0.3 pad 0.61: GND3 -0.5,-0.5; GND4 0.5,-0.5; GND5 0.5,0.5; GND6 -0.5,0.5
QFN20 = smd 0.3 x 0.75: !CS! 1,2; !RESET! 0.5,2; !RX0BF! 1,-2; !RX1BF! 0.5,-2; GND6 0,-2; OSC1 -0.5,-2; OSC2 -1,-2; RXCAN -1,2; TXCAN -0.5,2; VDD 0,2 | smd 0.75 x 0.3: !INT! 2,-1; !TX0RTS! -2,0.5; !TX1RTS! -2,0; !TX2RTS! -2,-1; CLKOUT -2,1; NC1 -2,-0.5; NC2 2,0; SCK 2,-0.5; SI 2,0.5; SO 2,1 | smd 2.5 x 2.5: GND 0,0
QFN20' = smd 0.8 x 0.3: 1_MISO -2,1; 2_A1 -2,0.5; 3_A0 -2,0; 4_!RESET! -2,-0.5; 5_!CS! -2,-1; 11_GP2 2,-1; 12_GP3 2,-0.5; 13_GP4 2,0; 14_GP5 2,0.5; 15_GP6 2,1 | smd 0.3 x 0.8: 6_NC -1,-2; 7_INT -0.5,-2; 8_NC 0,-2; 9_GP0 0.5,-2; 10_GP1 1,-2; 16_GP7 1,2; 17_GND 0.5,2; 18_VCC 0,2; 19_SCK -0.5,2; 20_MOSI -1,2 | smd 2.8 x 2.8: GND 0,0
SOT-23-8 = smd 0.48 x 1: 1_W -0.97,-1.3; 2_VDD -0.32,-1.3; 3_GND 0.33,-1.3; 4_CLK 0.98,-1.3; 5_SDI 0.97,1.3; 6_!CS! 0.32,1.3; 7_B -0.33,1.3; 8_A -0.98,1.3
DFN10 = smd 0.35 x 0.65: CANH -0.325,1.55; CANL 0.325,1.55; RXD 0.975,-1.55; SPLIT 0.975,1.55; STBY -0.975,1.55; TXD -0.975,-1.55; VDD 0.325,-1.55; VSS -0.325,-1.55 | smd 2.4 x 1.5: GND 0,0
SMT' = smd 0.3 x 0.7: 1 -1.25,1.27; 2 -0.75,1.27; 3 -0.25,1.27; 4 0.25,1.27; 5 0.75,1.27; 6 1.25,1.27 | smd 0.6 x 1: GND1 -2.5,-1.73; GND2 2.5,-1.73
SMD = smd 1 x 3.4: P$1 -1.185,0; P$2 1.185,0
SMT'' = smd 1.3 x 2.15: GND1 -2.85,1.04; GND2 2.85,1.045 | smd 0.8 x 1.2: P$1 1.27,-1.25; P$2 -0.02,-1.25; P$3 -1.25,-1.25
P1-13 = drill 1.321 pad 2.159 octagon: TP 0,0
R2512 = smd 1.8 x 3.2: 1 -2.8,0; 2 2.8,0
R0402 = smd 0.6 x 0.7: 1 -0.5,0; 2 0.5,0
0402-4R = smd 0.65 x 0.3: 1 -0.5,-0.75; 2 0.5,-0.75; 3 -0.5,-0.25; 4 0.5,-0.25; 5 -0.5,0.25; 6 0.5,0.25; 7 -0.5,0.75; 8 0.5,0.75
TP10SQ = smd 1 x 1: TP 0,0

### Placement (x,y rotation side)
C1  19.25,42.75 180 bottom
C2  19.25,40.75 180 bottom
C3  19.25,38.75 180 bottom
C4  11.25,28 180 bottom
C5  22.5,40.75 90 bottom
C6  4.5,27 270 bottom
C7  5.75,27 270 bottom
C8  29.75,22.25 180 bottom
C9  4.5,24 90 bottom
C10  5.75,24 90 bottom
C11  15.5,15.25 180 bottom
C12  24.5,40.75 90 bottom
C13  30.75,57.75 0 top
C14  30.75,60.25 180 top
C15  26.5,40.75 90 bottom
C16  25.5,36.75 270 bottom
C17  21.5,35.25 0 bottom
C18  4.25,60.25 180 top
C19  4.25,57.75 0 top
C20  30.25,30.25 90 bottom
C21  10,10.75 90 bottom
C22  19.25,25 180 bottom
C23  30.5,49.5 180 top
C24  30.25,34.75 270 bottom
C25  8.5,10.75 90 bottom
C26  25.75,21 0 bottom
C27  27,15 90 bottom
C28  25,15 90 bottom
C29  23,15 90 bottom
C30  23,7.75 270 bottom
C31  29,7.75 270 bottom
C32  27,7.75 270 bottom
C33  25,7.75 270 bottom
C34  17.25,11.25 0 bottom
D1  21,64.25 180 bottom
D2  14,64.25 0 bottom
D3  20.25,60.75 90 bottom
D4  18.5,60 270 bottom
D5  14.75,60.75 90 bottom
D6  16.5,60 270 bottom
D7  31.75,52.5 90 bottom
D8  16.25,41.25 270 bottom
D9  9.5,41.25 90 bottom
FD1  5.5,16 0 bottom
FD2  29.5,64.5 0 top
FD3  5.5,64.5 0 top
H  10.16,5.08 180 top
IC1  17.5,61 90 top
IC2  12.25,50.5 0 top
IC3  21,36.75 90 top
IC4  8,25.5 180 top
IC5  13.25,20 180 top
IC6  13.25,20 270 bottom
IC7  27.5,26 270 top
IC8  22.75,50.5 0 top
IC9  12.75,9.5 90 top
IC10  MCP23S08-E/ML  [QFN20']  20.5,25.5 90 top
IC11  27.5,20.75 270 top
IC12  6,8.25 270 bottom
IC13  21.75,11.5 0 top
ICSP  5034800600  [SMT']  12.5,16 0 top
L  7.62,5.08 180 top
L1  21,41 0 top
L2  26,11.5 270 top
LI-ION  505567-0371  [SMT'']  29.5,34.25 270 top
N1  25.5,64.25 0 top
N2  9.5,64.25 0 top
R1  8.5,32.5 180 bottom
R2  23.25,59.5 0 bottom
R3  23.25,61 0 bottom
R4  28.75,30.25 90 bottom
R5  27.5,30.25 270 bottom
R6  19.25,28.5 0 bottom
R7  19.25,26.25 0 bottom
R8  19.25,27.5 0 bottom
R9  25.75,22.25 180 bottom
R10  7.5,28.5 0 bottom
R11  7.5,29.75 180 bottom
R12  18.5,37 90 bottom
R13  26.25,30.25 90 bottom
R14  25,30.25 90 bottom
R15  11.75,14 270 bottom
R16  9.25,14 90 bottom
R17  21.75,22.25 0 bottom
R18  21.5,33.25 180 bottom
R19  7.75,57 180 bottom
R20  8.25,20 180 bottom
R21  8.25,18.5 0 bottom
R22  19.75,29.5 90 top
R23  19.5,8.5 270 bottom
R24  18.25,8.5 90 bottom
R25  21.25,12.5 180 bottom
R26  21.25,15 270 bottom
TP1  4,46.5 0 bottom
TP2  4,49.5 0 bottom
TP5  29.75,55.25 180 bottom
TP6  31.25,55.25 180 bottom
TP7  25.5,39.25 270 top
TP8  25.5,37.75 270 top
TP9  31.25,53.5 180 top
TP10  29.75,53.5 180 top
TP11  16.25,42 0 top
TP12  16.25,40.5 0 top
TP13  9.5,42.25 180 top
TP14  8,42.25 180 top

### Tracks (layer width: path | path; a pad name or v marks a point on that pad's centre or on a via)
5V0_TP-IN  (via drill 0.3)
  Top 0.25: v23.5,35.75 23.5,36 IC3.5-FB | IC3.7-VOUT 22.32,37 IC3.VOUT 22.32,37.5 IC3.8-VOUT
  Top 0.4: IC3.VOUT 23.25,37.26 23.5,37.5 v23.5,37.75
  Top 0.5: v23.5,37.75 v23.5,39.26 | v23.5,39.25 TP7.TP
  Route15 0.4: v23.5,35.75 v23.5,37.75
  Bottom 0.3: v23.5,35.75 23.5,34.25 22.5,33.25 R18.2
  Bottom 1: C12.1 C15.1 25.75,39.8 25.75,38.5 | C5.1 23.5,39.9 v23.5,39.25 | v23.5,39.25 v23.5,37.75 25.5,37.75 | 25.75,39.25 v23.5,39.25 | v23.5,38.5 25.75,38.5 | C16.1 25.5,37.75 | 25.5,37.75 25.75,37.75 25.75,38.5
5V0_TP-OUT  (via drill 0.3)
  Top 0.25: IC4.9_VDIG 5.75,23.6 v5.75,23 | IC4.8_VDD 5.75,27.4 v5.75,28 | IC5.18 ICSP.5
  Top 0.3: IC11.2_VDD 26.93,21.07 v27,21 | IC7.19_IN2 v30.75,26.51 v30.75,26 | v30.75,26 IC7.18_IN1 | IC7.4_PROG2 26.99,28.16 | 26.99,28.16 26.99,28.49 v27.25,28.75 | IC7.9_!TE! 24.99,25.49 24.75,25.25 v24.75,25 | IC7.3_SEL 27.5,28.16 26.99,28.16 | v13.77,15.89 13.77,16.14 13.25,16.67 ICSP.5 | IC9.VDD 9.5,9.5 v9.25,9.75 | 30,26 v30.75,26 | v30.75,26 v30.75,26.5 | IC10.4_!RESET! v21,22.5 | IC10.18_VCC 17.65,25.5 17.25,25.9 v17.25,26.4
  Top 0.5: TP8.TP v28.75,37.75
  Top 0.6: IC1.7 13.62,60.37 v13.5,60.25
  Route2 0.4: v17.5,46 19.75,48.25 19.75,51.25 23.75,55.25 R2.1 23.65,59.6 22.73,59.6 22.08,60.25 v13.5,60.25
  Bottom 0.3: C6.1 C7.1 v5.75,28 6.25,28.5 R10.2 | C9.1 C10.1 v5.75,23 | v27,21 C26.1 | R6.2 R8.2 R7.2 18.75,25.15 C22.1 | R16.5 R16.7 R15.8 | R16.5 R16.3 R16.1 | R4.2 v28.75,31 | v13.77,15.89 13.77,15.48 14,15.25 C11.1 | v9.5,12.5 R16.5 | R17.2 v21,22.5 | C25.1 9.25,10.1 | 9.25,10.1 C21.1 | v9.25,9.75 9.25,10.1
  Bottom 0.35: IC12.VDD 8.18,7.92 v8.5,8.25
  Bottom 0.4: R20.1 v7.5,20
  Bottom 0.5: C20.1 30.5,29.6 31,29.1 31,26.75 v30.75,26.5 v30.75,26 | R6.2 18.5,28.5 v18.25,28.75
  other vias: 28,37.75 27.25,37.75 23.75,59.5
  pour Route15 (isolate 0.3): 3.5,47 31.5,47 31.5,3.5 3.5,3.5
ANODE_DELON  (via drill 0.3)
  Top 0.3: v21.25,31.5 21.25,31.25 20.5,30.5 R22.2
  Top 0.5: IC8.3_ANODE2 24.02,46.02 v24,46
  Route2 0.4: v24,46 22.75,44.75 22.75,33 v21.25,31.5
ANODE_GRAETZ  (via drill 0.3)
  Top 0.3: R22.4 20,31 v20.5,31.5
  Top 0.5: IC8.1_ANODE1 v19,46
  Route2 0.4: v20.5,31.5 20.5,32 21.15,32.65 21.15,34.1 19.5,35.75 18.25,35.75 17.5,36.5 17.5,43.25 19,44.75 v19,46
ANODE_TUNING-CAP  (via drill 0.3)
  Top 0.3: R22.6 19.5,31 v19,31.5
  Top 0.5: IC2.3_ANODE2 13.52,46.02 v13.5,46
  Route2 0.4: v19,31.5 19,31.75 18.5,32.25 13.5,32.25 v13.5,46
ANODE_TUNING-CAP_BYPASS  (via drill 0.3)
  Top 0.3: R22.8 19,30.5 18.25,31.25 v18.25,31.5
  Top 0.5: IC2.1_ANODE1 v8.5,46
  Route15 0.4: v18.25,31.5 11.25,38.5 9,38.5 8.5,39 v8.5,46
CANH  (via drill 0.3, 1)
  Route15 0.4: H.P$1 9,6.25 6.25,6.25 v3.75,8.75
  Bottom 0.35: v3.75,8.75 3.92,8.57 IC12.CANH
  other vias: 10.16,5.08
CANL  (via drill 0.3, 1)
  Route15 0.4: L.P$1 6.42,5.08 v3.75,7.75
  Bottom 0.35: v3.75,7.75 3.92,7.92 IC12.CANL
  other vias: 7.62,5.08
CLOCKOUT  (via drill 0.3)
  Top 0.25: IC5.4 15.18,20.45 15.5,20.77 v15.5,22.25
  Top 0.3: IC9.OSC1 v15.75,9
  Route15 0.4: v15.5,22.25 15.5,9.25 v15.75,9
COMPARATOR_IN  (via drill 0.3)
  Top 0.25: IC5.10 11.52,21.48
  Top 0.254: 11.52,21.48 v11.5,21.5
  Top 0.6: v13,61.5 13.13,61.63 IC1.6
  Route2 0.4: v11.5,21.5 11.5,20.75 10.5,19.75 9.75,19.75 9.25,20.25 9.25,21.75 12.75,25.25 12.75,61.25 v13,61.5
COMPARATOR_REF  (via drill 0.3)
  Top 0.25: IC5.11 11.1,20.9 v10.75,21.25
  Bottom 0.25: v10.75,21.25 9.75,21.25 8.75,20.25 R21.1 R20.2
DEBUGWIRE/RESET
  Top 0.25: ICSP.6 13.75,17.93 13.7,17.98 IC5.19
DELON-NO
  Top 0.3: IC10.13_GP4 R22.1
DYNAMO1
  Top 0.6: IC1.3 24.64,61.63 25.5,62.5 N1.TP
  Bottom 0.8: N1.TP D1.A 20.95,61.65 D3.C 18.5,61.65 D4.A
  Bottom 0.9: 23.55,64.2 D1.A | 23.3,64.25 D1.A | 23.55,64.05 D1.A
DYNAMO2_AFTER_TUNING-CAP_SW  (via drill 0.3)
  Top 0.65: v16,55.5 16.04,55.5 16.06,55.48 IC2.5_DRAIN2-1
  Route15 0.9: C18.NEG 2.98,60.98 4,62 6.75,62 11.5,57.25 14.75,57.25 16,56 v16,55.5
DYNAMO2_BEFORE_G/D  (via drill 0.3)
  Top 0.65: IC2.7_DRAIN1-1 10.98,54.02 v11,54 | IC8.8_DRAIN1-2 18.94,54.06 v19,54 | IC8.6_DRAIN2-2 24.02,54.02 v24,54
  Route15 0.9: v24,54 v19,54 v11,54 9.25,54 5.52,57.73 C19.NEG
DYNAMO2_BEFORE_TUNING-CAP_SW  (via drill 0.3, 0.35)
  Top 0.6: N2.TP 9.5,59.25 v8.5,58.25 8.44,58.19 IC2.8_DRAIN1-2
  Top 0.65: IC2.6_DRAIN2-2 13.52,55.75 v13.75,55.75
  Route15 0.9: v8.5,58.25 11,55.75 v13.75,55.75
  Bottom 0.9: N2.TP D2.A
DYNAMO2_DELON
  Top 0.9: IC8.5_DRAIN2-1 30.73,54.98 32.02,56.27 C13.NEG C14.POS
DYNAMO2_GRAETZ  (via drill 0.3)
  Top 0.65: IC8.7_DRAIN1-1 21.48,55.27 v21.25,55.5
  Route15 0.9: v16.75,61.25 19.7,61.25 21.25,59.7 v21.25,55.5
  Bottom 0.5: D6.A 16.5,61.65 | D6.A 16.75,60.75 16.75,60.5 16.5,60.75 | D6.A v16.75,61.25
  Bottom 0.8: 16.5,61.65 D5.C
  Bottom 0.9: 16.5,60.75 D6.A
FB2  (via drill 0.3)
  Top 0.25: IC13.5-FB 21,9.75 20.5,9.25 v20.5,9
  Bottom 0.5: R24.2 R23.1 v20.5,9
GND_VIA_INCP  (via drill 0.3, 1)
  Top 0.2: IC6.GND 13.22,20
  Top 0.25: v21,36.5 IC3.10-PGND | IC4.10_DGND 6.75,25.5 | IC3.6-FB2 24.5,36.5 | IC4.6_INVG 7.25,26.5 | IC4.3_INCP 8.75,32.5 v11.25,32.5 v12,32.5 | 21.5,8.5 IC13.6-FB2 21.5,10.75 | IC13.4-GND 21.5,10.75 | 21.5,10.75 v21.5,11.5
  Top 0.254: IC3.6-FB2 21.75,36.5 v21,36.5 20.37,36.5 | IC4.16_RESET 9.75,25.5 9.25,25.5 | IC6.GND IC5.8 | IC4.2_REFG 9.25,25.5 | 9.25,25.5 8.25,25.5 IC4.GND1
  Top 0.3: IC7.11_GND2 26.51,25.01 | 26.51,25.01 IC7.10_GND1 | IC7.GND2 26.51,25.01 | ICSP.1 11.25,17.95 v11.14,18.06 | 13.83,9.5 IC9.GND IC9.GND6 | IC11.7_B 29.83,21.08 30,21.25 30,23.25 30.25,23.5 v31.5,23.5 | IC11.3_GND 24.5,20.42 | IC10.17_GND 20,26 | IC10.3_A0 IC10.GND | IC10.2_A1 20,22.25 | IC3.4-GND 21.75,36.5
  Top 0.5: 7.25,26.5 8.25,25.5 | v20.25,63 20.2,63 IC1.4 | 20,26 IC10.GND
  Route2 0.4: v20.25,63 13.5,63 12,61.5 v12,43.25
  Bottom 0.35: IC12.VSS 6,8.57
  Bottom 0.5: C17.2 20.85,36.35 v21,36.5 | C2.2 C1.2 20.7,42.25 v21,42.25 | C5.2 22.6,41.7 C12.2 | C16.2 25.95,35.8 v26,35.75 | IC12.GND 6,8.57 | IC10.GND 20,25 C22.2 | 20.2,39.75 v21,39.75
  Bottom 1: C3.2 20.2,38.85 20.2,39.75 C2.2
  other vias: 25,35.75 24.5,41.75 26.5,41.75 8,25.5 6,8.25 13.25,20 8.5,33.5 12.75,9.5 3.5,13.5 3.5,23.5 3.5,33.5 7.5,3.5 17.5,3.5 27.5,3.5 31.5,13.5 31.5,33.5 8.5,12.5 31.5,43.5 11.25,31.25 12,31.25 11.25,33.75 12,33.75 16.29,4.95 20.5,25.5 24.75,11.5 27.25,11.5 3.5,43.5 7.22,37.5 7.5,47 27.5,47 17.5,47
  pour Top (isolate 0.3): 3.5,47 31.5,47 31.5,3.5 3.5,3.5
  pour Bottom (isolate 0.254, rank 2): 3.5,47 31.5,47 31.5,3.5 3.5,3.5
GRAETZ_NC
  Top 0.3: IC10.14_GP5 R22.3
HH  (via drill 0.3, 2, 2 pad 1.3)
  Bottom 0.5: v6.75,29.75 R11.1
  Bottom 0.9: v16.5,59 v17,58.25 v18,58.25 v18.5,59 v17.5,59 16.46,59
  other vias: 3,67 3,3 32,3 32,67 17.5,68 27.5,68 7.5,68 2,63.5 33,63.5 2,53.5 33,53.5 33,43.5 33,33.5 2,23.5 2,13.5 33,23.5 33,13.5 7.5,2 17.5,2 27.5,2 2,33.5 2,43.5
  pour Route2 (isolate 0.3): 0,70 35,70 35,0 0,0
  pour Top (isolate 0.3, rank 2): 0,70 0,48.75 35,48.75 35,70
  pour Bottom (isolate 0.3, rank 2): 0,70 0,48.75 35,48.75 35,70
  pour Route15 (isolate 0.3): 0,70 35,70 35,48.75 0,48.75
  pour Top (isolate 0.3): 0,48.75 0,0 35,0 35,48.75 33,48.75 33,2 2,2 2,48.75
  pour Bottom (isolate 0.3, rank 2): 0,48.75 2,48.75 2,2 33,2 33,48.75 35,48.75 35,0 0,0
  pour Route15: 0,48.75 2,48.75 2,2 33,2 33,48.75 35,48.75 35,0 0,0
ICSP_DI/MISO  (via drill 0.3)
  Top 0.25: IC5.15 11.75,19.08 ICSP.2 11.75,16.75 11.5,16.5 v11.5,16.25
  Bottom 0.3: R15.5 v11.5,16.25
ICSP_DO/MOSI  (via drill 0.3)
  Top 0.25: IC5.16 12.35,18.25 12.25,18.15 ICSP.3 v12.25,15.75
  Bottom 0.3: R15.3 12,15.5 v12.25,15.75
ICSP_SCK  (via drill 0.3)
  Top 0.25: IC5.17 12.8,18 12.75,17.95 ICSP.4 12.75,16.27 13,16.02 v13,15.5
  Bottom 0.3: R15.1 12.5,15 v13,15.5
INCN  (via drill 0.3)
  Top 0.25: IC4.4_INCN 8.25,32.5 v5.75,32.5 | v5.75,32.5 6.12,32.5 | v5.75,33.75 v5.75,32.5 | v5.75,32.5 v5.75,31.25
  Bottom 0.5: 5.7,33.75 v5.75,33.75 | v5.75,31.25 v5.75,32.5 R1.1 | R1.1 5.7,31.25 v5,31.25 | R1.1 5.7,33.75 | 5.7,33.75 v5,33.75 | R1.1 v5,32.5
  Bottom 1: TP1.TP 5.75,46.5 v5.75,32.5
INT_MCP23S08  (via drill 0.3)
  Top 0.25: IC5.6 14.15,22.65 14.5,23 v15,23
  Top 0.254: IC5.6
  Top 0.3: IC10.7_INT v23.5,25
  Bottom 0.3: v15,23 18.25,23 19.25,24 23,24 23.5,24.5 v23.5,25
INT_MCP2515  (via drill 0.3)
  Top 0.25: v14.75,22.25 14.75,20.92 IC5.5
  Top 0.3: v14.75,12.5 13.75,12.5 IC9.!INT!
  Route15 0.4: v14.75,12.5 v14.75,22.25
INVP  (via drill 0.3)
  Top 0.25: v7.5,30.75 7.75,30.5 IC4.5_INVP
  Bottom 0.3: R10.1 R11.2 8,30.25 v7.5,30.75
MCP73871_CE  (via drill 0.3)
  Top 0.3: IC7.17_CE 30.26,25.49 30.5,25.25 v30.75,25.25 | IC10.12_GP3 21,29 v21.25,29.25
  Route15 0.4: v21.25,29.25 21.25,24.25 29.75,24.25 v30.75,25.25
MCP73871_PG_PIN  (via drill 0.3)
  Top 0.3: IC7.!6_PG! 24.26,26.99 23.75,27.5 22.25,27.5 | v22.25,28 22.25,27.5 | IC10.11_GP2 22.25,27.5
  Bottom 0.3: R6.1 21.75,28.5 v22.25,28
MCP73871_STAT1/!LBO!_PIN  (via drill 0.3)
  Top 0.3: IC7.8_STAT1/!LBO! 24.62,26 24.37,25.75 v24.25,25.75 23.4,25.75 23.15,26 IC10.9_GP0
  Bottom 0.3: R7.1 22,26.25 22.5,25.75 v24.25,25.75
MCP73871_STAT2_PIN  (via drill 0.3)
  Top 0.3: IC7.7_STAT2 v23.76,26.51 v23.75,26.5 IC10.10_GP1
  Bottom 0.3: v23.75,26.5 22.75,26.5 21.75,27.5 R8.1
N$1
  Top 0.254: IC3.11-L1 20.5,39.06 19.91,39.66
  Top 0.3: L1.P$1 19.82,39.66 19.91,39.66
N$5
  Top 0.254: IC3.9-L2 21.5,39.06 22.18,39.75
  Top 0.3: L1.P$2 22.18,39.75
N$9
  Top 0.25: IC13.11-L1 24.24,12 24.93,12.69 L2.P$1
N$10
  Top 0.25: IC13.9-L2 24.24,11 24.93,10.31 L2.P$2
N$17  (via drill 0.3)
  Top 0.25: IC4.1_REFC v9.75,28
  Bottom 0.5: C4.1 v9.75,28
N$19  (via drill 0.3)
  other vias: 19.5,10.5
NTC  (via drill 0.3)
  Bottom 0.3: R14.2 R13.2
  Bottom 0.4: LI-ION.P$2 27.27,34.27 26.25,33.25 R13.2
  other vias: 28.25,34.27
OPAMP_NEG  (via drill 0.3)
  Top 0.6: IC1.2 22.61,60.37 v22.75,60.5
  Bottom 0.5: R3.2 v22.75,60.5 R2.2
PG1  (via drill 0.3)
  Top 0.25: IC3.2-PG 20.75,33.5 v20.5,33.25
  Bottom 0.4: R18.1 v20.5,33.25
PG2  (via drill 0.3)
  Top 0.25: IC13.2-PG 19.75,11.75 19.5,12 v19.25,12
  Bottom 0.5: R25.1 20.25,12 v19.25,12
PROG1
  Top 0.3: IC11.1_W 26.95,21.72 27.5,22.27 IC7.13_PROG1
PROG3  (via drill 0.3)
  Top 0.3: IC7.12_PROG3 26.99,23.49 v26.75,23.25
  Bottom 0.3: v26.75,23.25 26.25,22.75 R9.2
RESET  (via drill 0.3)
  Top 0.3: IC9.!RESET! 10,10 9,11 v6.75,11
  Route15 0.4: v6.75,11 6.75,15.25 v7.75,16.25
  Bottom 0.3: R16.4 9,15.5 8.25,16.25 v7.75,16.25
RXCAN  (via drill 0.3)
  Top 0.3: IC9.RXCAN 10.25,8.5 v9.5,7.75
  Bottom 0.35: IC12.RXD 8.53,7.28 9,7.75 v9.5,7.75
SOLAR-CELL_TP-IN  (via drill 1)
  Top 0.5: v7.2,40.03 7.2,41.45 TP14.TP
SOLAR-CELL_TP-OUT  (via drill 0.3)
  Bottom 0.5: D9.C TP13.TP
  other vias: 9.5,42.25
SPI_MISO  (via drill 0.3)
  Top 0.25: IC4.11_SDO 7.25,23 7,22.75 v6.75,22.75
  Top 0.3: v11.5,12.25 11.75,12 IC9.SO | IC10.1_MISO 19.5,23 19,22.5 v18.75,22.5
  Route2 0.4: v11.5,12.25 11.5,13.25 13,14.75 14.5,14.75 17,17.25 v17,22.25
  Route15 0.4: v6.75,22.75 9.5,25.5 17.75,25.5 18.75,24.5 v18.75,22.5 18.5,22.25 v17,22.25
  Bottom 0.3: R15.6 v11.5,12.25
SPI_MOSI  (via drill 0.3)
  Top 0.25: IC4.12_SDI 7.75,22.5 v7.5,22.25
  Top 0.3: v12.25,12.5 IC9.SI | IC11.5_SDI 28.77,19.75 v28,19.75 | IC10.20_MOSI 18,24.5 17.5,24 v17.5,23.75
  Route2 0.4: v12.25,12.5 12.25,13 13.25,14 14.75,14 17.75,17 17.75,23.75 v17.5,23.75 18.75,23.75 19.5,23 19.5,22 21,20.5 25.25,20.5 26.75,19 27.75,19 28,19.25 v28,19.75
  Route15 0.4: v12.25,12.5 12.25,12.75 8.5,16.5 8.5,21.25 v7.5,22.25
  Bottom 0.3: v12.25,12.5 12,12.75 R15.4
SPI_SCK  (via drill 0.3)
  Top 0.25: IC4.13_SCLK 8.25,22.5 v8.5,22.25
  Top 0.3: v13,12.75 13.25,12.5 IC9.SCK | IC11.4_CLK 26.98,19.77 v27,19.75 | v17.25,24.75 17.5,25 IC10.19_SCK
  Route2 0.4: v17.25,24.75 18.75,24.75 20.25,23.25 20.25,22.25 21.25,21.25 25.5,21.25 v27,19.75 | v13,12.75 13.5,13.25 15,13.25 20.5,18.75 v24,18.75
  Route15 0.4: v24,18.75 26,18.75 v27,19.75 | v17.25,24.75 9.75,24.75 8.5,23.5 v8.5,22.25
  Bottom 0.3: v13,12.75 12.5,13.25 R15.2
SPI_SS_AD5160  (via drill 0.3)
  Top 0.25: IC5.7 13.7,22.05 v13.5,22.25
  Top 0.254: IC11.6_!CS! 28.07,20.43 v28,20.5
  Route2 0.4: v28,20.5 28,21 27,22 22.5,22 19,25.5 16.25,25.5 13.5,22.75 v13.5,22.25 13.5,21.75 10,18.25 v10,17.25
  Bottom 0.3: R16.8 v10,17.25
SPI_SS_LMP92064SD  (via drill 0.3)
  Top 0.25: v9.25,22.75 9,22.75 8.75,23 IC4.14_CSB | v12.25,22.25 12.5,22.25 12.8,21.95 IC5.9
  Route15 0.4: v9.25,17 v9.25,22.75
  Bottom 0.3: v9.25,17 9.5,16.75 R16.6 | v9.25,22.75 11.75,22.75 v12.25,22.25
SPI_SS_MCP23S08  (via drill 0.3)
  Top 0.254: IC5.1 14.77,18 15.27,17.5 v16.25,17.5
  Top 0.3: IC10.5_!CS! 22,23.5 v22.25,23.25
  Route15 0.4: v16.25,17.5 19,17.5 22.25,20.75 v22.25,23.25
  Bottom 0.3: R17.1 v22.25,23.25
SPI_SS_MCP2515  (via drill 0.3)
  Top 0.25: IC5.14 11.3,19.55 10.5,18.75 10.5,17.75 10.75,17.5 v10.75,15.75
  Top 0.3: IC9.!CS! v10.75,15.75
  Bottom 0.3: v10.75,15.75 11,15.5 R15.7
STBY  (via drill 0.3)
  Top 0.25: IC5.13 11,20 8.5,17.5 8.5,15.5 v8.25,15.25
  Route2 0.4: v8.25,15.25 3.75,10.75 v3.75,9.75
  Bottom 0.3: R16.2 8.5,15 v8.25,15.25
  Bottom 0.35: IC12.STBY 4.45,9.75 v3.75,9.75
THERM  (via drill 0.3)
  Top 0.3: IC7.5_THERM 26.51,28.24 26.25,28.5 v26.25,28.75
  Bottom 0.3: R13.1 v26.25,28.75
TPS630701_PWM  (via drill 0.3)
  Top 0.25: IC3.1-PS/S 20.25,34.5 v20,34.25 | IC5.12 10.05,20.45 v10,20.5 | IC13.1-PS/S 20,12.25 v19.5,12.75
  Route2 0.4: v10,20.5 10,21.5 13.5,25 13.5,30.62 19.12,30.62 19.75,31.25 19.75,34 v20,34.25
  Bottom 0.3: v19.5,12.75 19.5,14.5 17.75,16.25 14.75,16.25 14,17 11.3,17 10,18.3 v10,20.5
TUNIN_CAP_BIAS
  Route2 0.65: C18.POS 5.52,60.06 3.21,57.75 C19.POS
  Bottom 0.65: C18.POS 6,60.25 7.09,59.15 7.09,57.16 R19.1
TUNING-CAP_BYPASS_NC
  Top 0.3: R22.7 19,27.75 18.5,27.25 IC10.16_GP7
TUNING-CAP_NO
  Top 0.3: IC10.15_GP6 R22.5
TXCAN  (via drill 0.3)
  Top 0.3: IC9.TXCAN 10,9 9.75,8.75 v9.5,8.75
  Bottom 0.35: IC12.TXD 8.53,9.22 9,8.75 v9.5,8.75
V_LI-ION_BATTERY-CELL  (via drill 0.3)
  Top 0.3: IC7.15_VBAT2 28.49,23.25 | IC7.14_VBAT1 28.01,23.25 28.49,23.25 | 28.49,23.25 v29.25,23.25 29.38,23.38 IC7.16_BAT_SENSE
  Route2 0.4: v29.25,23.25 30.25,23.25 31.9,24.9 31.9,31.35 30.27,32.98 LI-ION.P$1
  Bottom 0.5: C8.1 29.1,23.1 v29.25,23.25
  other vias: 28.25,32.98
V_LI-ION_OUT  (via drill 0.3)
  Top 0.25: 22.25,13 IC13.VIN | IC13.12-VIN IC13.13-VIN 22.1,13
  Top 0.3: IC7.1_OUT1 30.25,27.88 v30.25,27.75 30.25,26.99 IC7.20_OUT2 | 22.1,13 22.25,13
  Top 0.4: v22.25,14 22.25,13
  Route15 0.5: TP11.TP 17.75,43.5 29,43.5 32.25,40.25 32.25,34.5 | 32.25,34.5 32.25,20.5 25.75,14 v23.75,14 v23,14 v22.25,14 | v30.25,27.75 C24.2 30.65,34.5 32.25,34.5
  Bottom 0.5: R25.2 22.25,13 v22.25,14
  Bottom 0.8: C27.1 C28.1 | C28.1 23.1,14.05 | v23,14 22.45,14 | v23.75,14 24.95,14 C28.1 | v22.25,14 24.25,14
  Bottom 1: 23.1,14.05 C29.1
  other vias: 16.25,42 30.25,34.1
V_LI-ION_TP-OUT  (via drill 0.3)
  Bottom 0.5: D8.C TP12.TP
  other vias: 16.25,40.5
V_RECT_TP-IN
  Bottom 0.3: 20.25,57 20.22,56.97
  Bottom 0.9: D5.A 14.75,57 | 14.75,57 20.25,57 | D3.A 20.25,57 | 20.25,57 29.48,57 C13.POS 29.73,57.5 29.73,55.25 TP5.TP | 14.75,57 R19.2
V_RECT_TP-OUT
  Bottom 0.3: TP6.TP 31.3,55.2
  Bottom 0.8: D7.C 31.25,53.9 TP6.TP
V_REGULATED_TP-IN
  Top 0.5: 31.77,49.73 31.25,50.25 TP9.TP
  Top 0.9: C23.POS 31.77,49.73
  Bottom 0.9: C23.POS 31.77,51.48 D7.A
V_REGULATED_TP-OUT  (via drill 0.3, 0.35)
  Top 0.25: IC3.13-VIN 19.68,37 IC3.VIN 19.68,37.5 IC3.12-VIN
  Top 0.4: v18.5,37.75 R12.2 18.75,37.25 IC3.VIN
  Top 0.406: v18.5,37.75 v18.5,39.25
  Top 1: 29.75,53.51 TP10.TP
  Route2 0.9: v18.5,37.75 18.5,43 29,53.5 TP10.TP
  Route15 1: v9.5,39.5 18.5,39.5 v18.5,37.75 v18.5,38.5 v18.5,39.25
  Bottom 0.3: v18.5,37.75 R12.2
  Bottom 0.5: C1.1 16.25,42.75 D8.A | D9.A v9.5,39.5
  Bottom 1: C1.1 C2.1 18.3,38.75 | C3.1 18.3,38.75 | v18.5,37.75 18.3,37.75 18.3,38.75
  other vias: 29.75,53.5
VAUX1  (via drill 0.3)
  Top 0.25: v22,34.25 21.5,34.25 21.25,34.5
  Top 0.254: IC3.3-VAUX 21.25,34.5
  Bottom 0.3: v22,34.25 22.15,34.4 C17.1
VAUX2  (via drill 0.3)
  Top 0.25: IC13.3-VAUX v19.25,11.25
  Bottom 0.5: C34.1 v19.25,11.25
VOUT  (via drill 0.3, 1)
  Top 0.25: IC13.VOUT 22.25,9.93 22.25,9.92 | 22.25,10.15 IC13.7-VOUT 22.25,10.15
  Top 0.3: IC13.8-VOUT 22.25,10.15 IC13.VOUT | IC13.VOUT 22.25,10.15
  Top 0.4: v23.75,9 v23,9 v22.25,9 22.25,9.92
  Bottom 0.5: R23.2 20.69,6.81
  Bottom 0.8: C31.1 C32.1 C33.1 | 24.9,8.6 C30.1 22.25,8.6 | v23,9 22.45,9 | 24,9 v22.25,9 22.25,8.6 | v18.83,4.95 20.69,6.81 22.25,8.37 22.25,8.6
  Bottom 1: C33.1 24.9,8.6
VOUT_EN1  (via drill 0.3)
  Top 0.254: IC3.14-EN R12.1
  other vias: 18.5,36.5
VOUT_EN2  (via drill 0.3)
  Top 0.25: IC5.20 14.25,18.38 14.25,17.88 17.88,14.25 v21,14.25 21.5,13.75 IC13.14-EN
  Bottom 0.3: R26.2 v21,14.25
VPCC  (via drill 0.3)
  Top 0.3: IC7.2_VPCC 28.01,28.51 v28.25,28.75
  Bottom 0.3: R4.1 28.25,29.75 | 28.25,29.75 R5.2 | v28.25,28.75 28.25,29.75
XTAL1  (via drill 0.3)
  Top 0.25: v16.25,20.75 16.25,20.25 16,20 IC5.3
  Bottom 0.3: v16.25,20.75 15.8,21.2 IC6.XTAL1
XTAL2  (via drill 0.3)
  Top 0.25: IC5.2 15.95,19.55 16.25,19.25 v16.25,18.75
  Bottom 0.3: IC6.XTAL2 16.2,18.8 v16.25,18.75
ZENER_COMMON
  Bottom 1.8: D2.C D1.C

### Text on the board
Top: GND | GND | GND | GND_VIA_INCP | GND_VIA_INCP | GND_VIA_INCP | GND_VIA_INCP | GND_VIA_INCP
Route2: GND | GND | GND | GND | GND | GND | GND | GND
Route15: GND | GND | GND | 5V0_TP-OUT | 5V0_TP-OUT | 5V0_TP-OUT | 5V0_TP-OUT | 5V0_TP-OUT
Bottom: GND | GND | GND | GND_VIA_INCP | GND_VIA_INCP | GND_VIA_INCP | GND_VIA_INCP | GND_VIA_INCP
tPlace: TP2 | TP5 | TP3 | TP4 | solar | - | + | Vout
bPlace: TP1 | TP7
tStop: GND | ejovrh / rev.2 | Čos POC | vGND
bStop: GND | GND | vGND | vGND